# Altium project Arduino - FPGA Development Board.PrjPcb
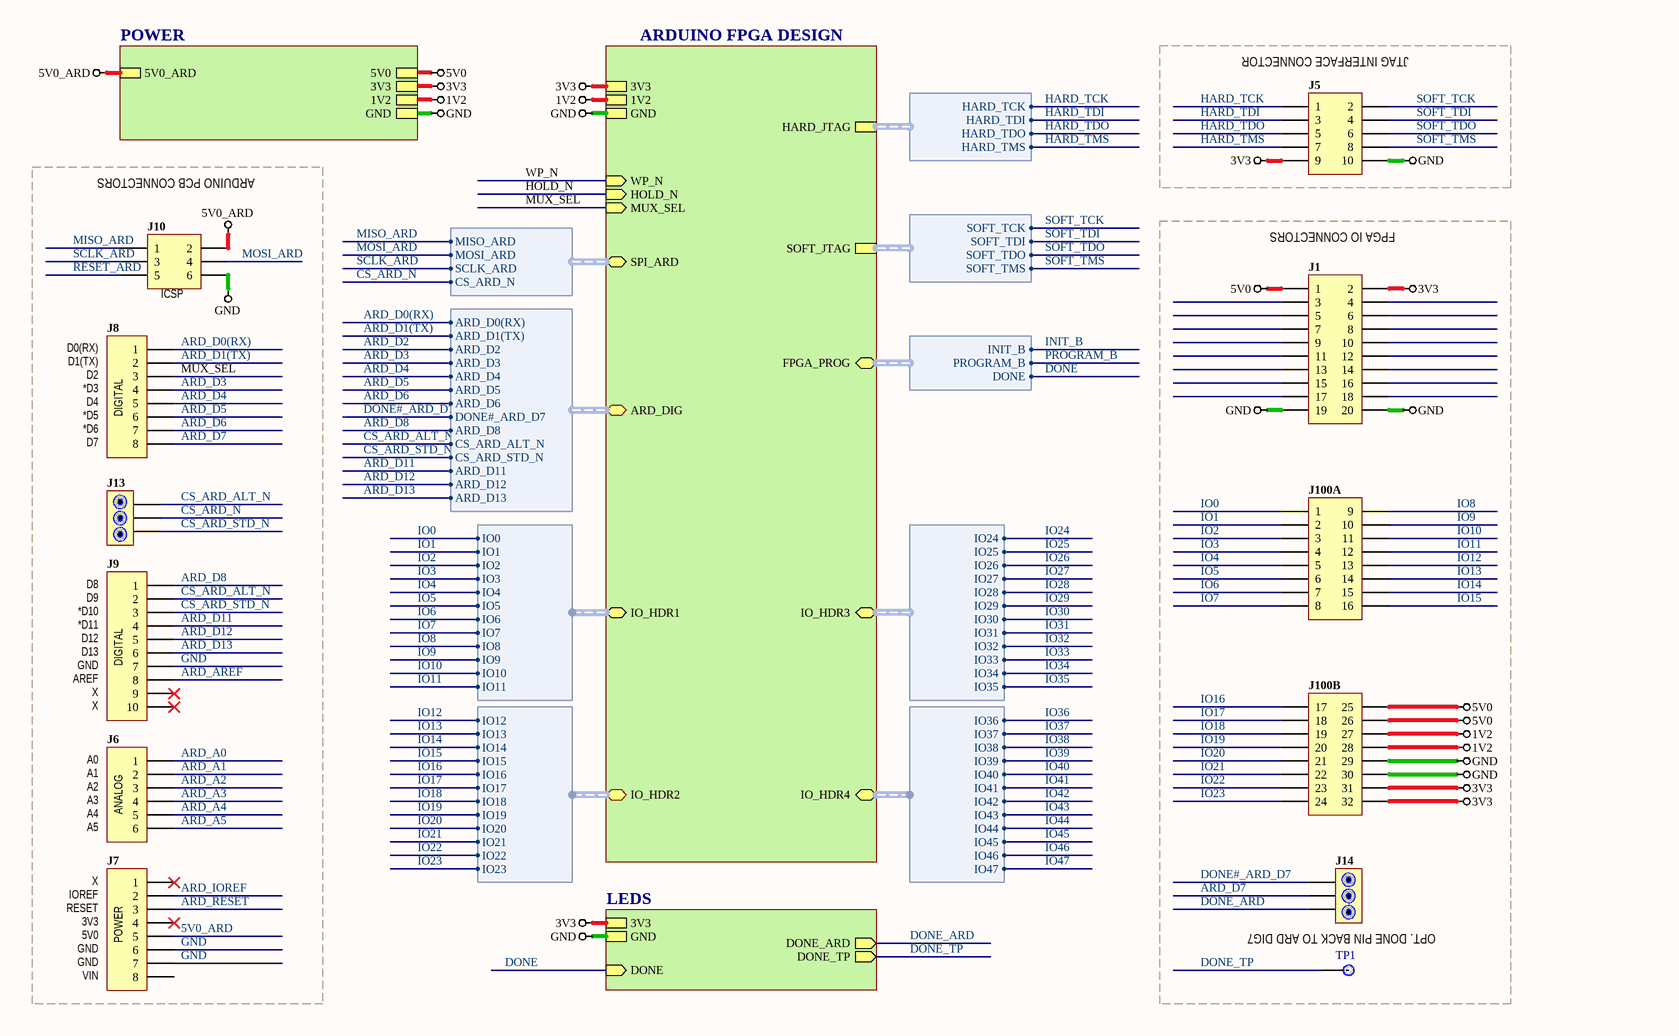
[diagram p0: Arduino FPGA Top-Level Interface.SchDoc]
10 sheets, 85 parts. Net scope: hierarchical (ports join the sheet entries above them; power ports are global).
Board file: Arduino_FPGA_Shield.PcbDoc
Sheets:
  Arduino FPGA Top-Level Interface.SchDoc
    ARDUINO FPGA DESIGN = Arduino FPGA Design.SchDoc
      FLASH_MEMORY = Flash - S25FL216K0PMFI041.SchDoc
      FPGA_SUBSYSTEM = FPGA - XC6SLX9-2TQG144C.schdoc
        U_FPGA - Decoupling = FPGA - Decoupling.SchDoc
      SPI MUX = Arduino FPGA SPI MUX.SchDoc
      SRAM0 = SRAM0 - IS61WV12816DBLL-10BLI.SchDoc
    POWER = Power - 5V0.SchDoc
      Power - 3V3 = Power - 3V3.SchDoc
    LEDS = LEDS - Status.SchDoc

## Sheet Arduino FPGA Top-Level Interface.SchDoc
size A4

### Parts
J1  Header 10X2  [HEADER_10X2]  (value not drawn)
J5  Header 5X2  [HDR2X5]  (value not drawn)
J6  Header 6  [1X06]  (value not drawn)
J7  Header 8  [1X08]  (value not drawn)
J8  Header 8  [1X08]  (value not drawn)
J9  Header 10  [1X10@1]  (value not drawn)
J10  Header 3X2  [2X03]  (value not drawn)
J13  3-WAY JUMPER  [HDR1X3]  (value not drawn)
J14  3-WAY JUMPER  [HDR1X3]  (value not drawn)
J100  ARR_32P  [ARR_100X100X32P]  (value not drawn)  (parts A,B of 2)
TP1  TESTPOINT_TH  [TESTPOINT_TH]  (value not drawn)

### Blocks framed on the sheet
JTAG INTERFACE CONNECTOR: J5
ARDUINO PCB CONNECTORS: J6-J10 J13

### Sub-sheets
ARDUINO FPGA DESIGN = Arduino FPGA Design.SchDoc: 3V3, GND, 1V2, HARD_JTAG (harness HARD_JTAG), SOFT_JTAG (harness SOFT_JTAG), WP_N (in), HOLD_N (in), IO_HDR2 (harness IO_HDR2), IO_HDR3 (harness IO_HDR3), IO_HDR4 (harness IO_HDR4), MUX_SEL (in), IO_HDR1 (harness IO_HDR1), FPGA_PROG (harness FPGA_PROGRAM), ARD_DIG (harness ARDUINO_DIGITAL), SPI_ARD (harness SPI_ARD)
LEDS = LEDS - Status.SchDoc: 3V3, GND, DONE (in), DONE_ARD (out), DONE_TP (out)
POWER = Power - 5V0.SchDoc: 5V0, 3V3, 1V2, GND, 5V0_ARD

### Harnesses
HARD_JTAG: HARD_TCK, HARD_TDI, HARD_TDO, HARD_TMS
SOFT_JTAG: SOFT_TCK, SOFT_TDI, SOFT_TDO, SOFT_TMS
FPGA_PROGRAM: INIT_B, PROGRAM_B, DONE
SPI_ARD: MISO_ARD, MOSI_ARD, SCLK_ARD, CS_ARD_N
IO_HDR1: IO0, IO1, IO2, IO3, IO4, IO5, IO6, IO7, IO8, IO9, IO10, IO11
IO_HDR3: IO24, IO25, IO26, IO27, IO28, IO29, IO30, IO31, IO32, IO33, IO34, IO35
IO_HDR4: IO36, IO37, IO38, IO39, IO40, IO41, IO42, IO43, IO44, IO45, IO46, IO47
IO_HDR2: IO12, IO13, IO16, IO17, IO18, IO19, IO20, IO21, IO22, IO23, IO14, IO15
ARDUINO_DIGITAL: ARD_D0(RX), ARD_D1(TX), ARD_D2, ARD_D3, ARD_D4, ARD_D5, ARD_D6, DONE#_ARD_D7, ARD_D8, CS_ARD_ALT_N, CS_ARD_STD_N, ARD_D11, ARD_D12, ARD_D13

### Nets
1V2: J100.27 J100.28 ; sheet ARDUINO FPGA DESIGN/1V2, sheet POWER/1V2
3V3: J1.2 J5.9 J100.31 J100.32 ; sheet ARDUINO FPGA DESIGN/3V3, sheet POWER/3V3, sheet LEDS/3V3
5V0: J1.1 J100.25 J100.26 ; sheet POWER/5V0
5V0_ARD: J7.5 ; sheet POWER/5V0_ARD
GND: J1.19 J1.20 J5.10 J7.6 J7.7 J9.7 J10.6 J100.29 J100.30 ; sheet ARDUINO FPGA DESIGN/GND, sheet POWER/GND, sheet LEDS/GND
ARD_A0: J6.1
ARD_A1: J6.2
ARD_A2: J6.3
ARD_A3: J6.4
ARD_A4: J6.5
ARD_A5: J6.6
ARD_AREF: J9.8
ARD_D0(RX): J8.1 ; sheet ARDUINO FPGA DESIGN/ARD_DIG.ARD_D0(RX)
ARD_D1(TX): J8.2 ; sheet ARDUINO FPGA DESIGN/ARD_DIG.ARD_D1(TX)
ARD_D2: sheet ARDUINO FPGA DESIGN/ARD_DIG.ARD_D2
ARD_D3: J8.4 ; sheet ARDUINO FPGA DESIGN/ARD_DIG.ARD_D3
ARD_D4: J8.5 ; sheet ARDUINO FPGA DESIGN/ARD_DIG.ARD_D4
ARD_D5: J8.6 ; sheet ARDUINO FPGA DESIGN/ARD_DIG.ARD_D5
ARD_D6: J8.7 ; sheet ARDUINO FPGA DESIGN/ARD_DIG.ARD_D6
ARD_D7: J8.8 J14.2
ARD_D8: J9.1 ; sheet ARDUINO FPGA DESIGN/ARD_DIG.ARD_D8
ARD_D11: J9.4 ; sheet ARDUINO FPGA DESIGN/ARD_DIG.ARD_D11
ARD_D12: J9.5 ; sheet ARDUINO FPGA DESIGN/ARD_DIG.ARD_D12
ARD_D13: J9.6 ; sheet ARDUINO FPGA DESIGN/ARD_DIG.ARD_D13
ARD_IOREF: J7.2
ARD_RESET: J7.3
CS_ARD_ALT_N: J9.2 J13.3 ; sheet ARDUINO FPGA DESIGN/ARD_DIG.CS_ARD_ALT_N
CS_ARD_N: J13.2 ; sheet ARDUINO FPGA DESIGN/SPI_ARD.CS_ARD_N
CS_ARD_STD_N: J9.3 J13.1 ; sheet ARDUINO FPGA DESIGN/ARD_DIG.CS_ARD_STD_N
DONE: sheet LEDS/DONE, sheet ARDUINO FPGA DESIGN/FPGA_PROG.DONE
DONE#_ARD_D7: J14.3 ; sheet ARDUINO FPGA DESIGN/ARD_DIG.DONE#_ARD_D7
DONE_ARD: J14.1 ; sheet LEDS/DONE_ARD
DONE_TP: TP1.1 ; sheet LEDS/DONE_TP
HARD_TCK: J5.1 ; sheet ARDUINO FPGA DESIGN/HARD_JTAG.HARD_TCK
HARD_TDI: J5.3 ; sheet ARDUINO FPGA DESIGN/HARD_JTAG.HARD_TDI
HARD_TDO: J5.5 ; sheet ARDUINO FPGA DESIGN/HARD_JTAG.HARD_TDO
HARD_TMS: J5.7 ; sheet ARDUINO FPGA DESIGN/HARD_JTAG.HARD_TMS
IO0: J100.1 ; sheet ARDUINO FPGA DESIGN/IO_HDR1.IO0
IO1: J100.2 ; sheet ARDUINO FPGA DESIGN/IO_HDR1.IO1
IO2: J100.3 ; sheet ARDUINO FPGA DESIGN/IO_HDR1.IO2
IO3: J100.4 ; sheet ARDUINO FPGA DESIGN/IO_HDR1.IO3
IO4: J100.5 ; sheet ARDUINO FPGA DESIGN/IO_HDR1.IO4
IO5: J100.6 ; sheet ARDUINO FPGA DESIGN/IO_HDR1.IO5
IO6: J100.7 ; sheet ARDUINO FPGA DESIGN/IO_HDR1.IO6
IO7: J100.8 ; sheet ARDUINO FPGA DESIGN/IO_HDR1.IO7
IO8: J100.9 ; sheet ARDUINO FPGA DESIGN/IO_HDR1.IO8
IO9: J100.10 ; sheet ARDUINO FPGA DESIGN/IO_HDR1.IO9
IO10: J100.11 ; sheet ARDUINO FPGA DESIGN/IO_HDR1.IO10
IO11: J100.12 ; sheet ARDUINO FPGA DESIGN/IO_HDR1.IO11
IO12: J100.13 ; sheet ARDUINO FPGA DESIGN/IO_HDR2.IO12
IO13: J100.14 ; sheet ARDUINO FPGA DESIGN/IO_HDR2.IO13
IO14: J100.15 ; sheet ARDUINO FPGA DESIGN/IO_HDR2.IO14
IO15: J100.16 ; sheet ARDUINO FPGA DESIGN/IO_HDR2.IO15
IO16: J100.17 ; sheet ARDUINO FPGA DESIGN/IO_HDR2.IO16
IO17: J100.18 ; sheet ARDUINO FPGA DESIGN/IO_HDR2.IO17
IO18: J100.19 ; sheet ARDUINO FPGA DESIGN/IO_HDR2.IO18
IO19: J100.20 ; sheet ARDUINO FPGA DESIGN/IO_HDR2.IO19
IO20: J100.21 ; sheet ARDUINO FPGA DESIGN/IO_HDR2.IO20
IO21: J100.22 ; sheet ARDUINO FPGA DESIGN/IO_HDR2.IO21
IO22: J100.23 ; sheet ARDUINO FPGA DESIGN/IO_HDR2.IO22
IO23: J100.24 ; sheet ARDUINO FPGA DESIGN/IO_HDR2.IO23
IO31: sheet ARDUINO FPGA DESIGN/IO_HDR3.IO31
IO32: sheet ARDUINO FPGA DESIGN/IO_HDR3.IO32
IO33: sheet ARDUINO FPGA DESIGN/IO_HDR3.IO33
IO34: sheet ARDUINO FPGA DESIGN/IO_HDR3.IO34
IO35: sheet ARDUINO FPGA DESIGN/IO_HDR3.IO35
IO36: sheet ARDUINO FPGA DESIGN/IO_HDR4.IO36
IO37: sheet ARDUINO FPGA DESIGN/IO_HDR4.IO37
IO38: sheet ARDUINO FPGA DESIGN/IO_HDR4.IO38
IO39: sheet ARDUINO FPGA DESIGN/IO_HDR4.IO39
IO40: sheet ARDUINO FPGA DESIGN/IO_HDR4.IO40
IO41: sheet ARDUINO FPGA DESIGN/IO_HDR4.IO41
IO42: sheet ARDUINO FPGA DESIGN/IO_HDR4.IO42
IO43: sheet ARDUINO FPGA DESIGN/IO_HDR4.IO43
IO44: sheet ARDUINO FPGA DESIGN/IO_HDR4.IO44
IO45: sheet ARDUINO FPGA DESIGN/IO_HDR4.IO45
IO46: sheet ARDUINO FPGA DESIGN/IO_HDR4.IO46
IO47: sheet ARDUINO FPGA DESIGN/IO_HDR4.IO47
MISO_ARD: J10.1 ; sheet ARDUINO FPGA DESIGN/SPI_ARD.MISO_ARD
MOSI_ARD: J10.4 ; sheet ARDUINO FPGA DESIGN/SPI_ARD.MOSI_ARD
MUX_SEL: J8.3 ; sheet ARDUINO FPGA DESIGN/MUX_SEL
RESET_ARD: J10.5
SCLK_ARD: J10.3 ; sheet ARDUINO FPGA DESIGN/SPI_ARD.SCLK_ARD
SOFT_TCK: J5.2 ; sheet ARDUINO FPGA DESIGN/SOFT_JTAG.SOFT_TCK
SOFT_TDI: J5.4 ; sheet ARDUINO FPGA DESIGN/SOFT_JTAG.SOFT_TDI
SOFT_TDO: J5.6 ; sheet ARDUINO FPGA DESIGN/SOFT_JTAG.SOFT_TDO
SOFT_TMS: J5.8 ; sheet ARDUINO FPGA DESIGN/SOFT_JTAG.SOFT_TMS

Not connected (* = marked no-connect by the designer): J1 3 4 5 6 7 8 9 10 11 12 13 14 15 16 17 18; J7 1* 4* 8; J9 9* 10*; J10 2

### Notes on the sheet
- FPGA IO CONNECTORS
- (near J10) ICSP
- (near J8) D0(RX)
- (near J8) D1(TX)
- (near J8) D2
- (near J8) *D3
- (near J8) D4
- (near J8) *D5
- (near J8) *D6
- D7
- (near J8) DIGITAL
- D8
- D9
- (near J9) *D10
- (near J9) *D11
- (near J9) D12
- (near J9) D13
- (near J9) GND
- (near J9) AREF
- (near J9) X
- X
- (near J9) DIGITAL
- A0
- (near J6) A1
- (near J6) A2
- (near J6) A3
- (near J6) A4
- A5
- (near J6) ANALOG
- (near J7) IOREF
- (near J7) RESET
- (near J7) 3V3
- OPT. DONE PIN BACK TO ARD DIG7
- (near J7) 5V0
- (near J7) GND
- (near J7) VIN
- (near J7) POWER
- Labels drawn without touching a wire or pin: 5V0_ARD

### Library data of the parts
J1 = Header 10X2: Header, 10-Pin, Dual row; LatestRevisionDate: 17-Jul-2002; LatestRevisionNote: Re-released for DXP Platform.; Publisher: Altium Limited
J5 = Header 5X2: Header, 5-Pin, Dual row; LatestRevisionDate: 17-Jul-2002; LatestRevisionNote: Re-released for DXP Platform.; Publisher: Altium Limited
J6 = Header 6: Header, 6-Pin; LatestRevisionDate: 17-Jul-2002; LatestRevisionNote: Re-released for DXP Platform.; Publisher: Altium Limited
J7 J8 = Header 8: Header, 8-Pin; LatestRevisionDate: 17-Jul-2002; LatestRevisionNote: Re-released for DXP Platform.; Publisher: Altium Limited
J9 = Header 10: Header, 10-Pin; LatestRevisionDate: 17-Jul-2002; LatestRevisionNote: Re-released for DXP Platform.; Publisher: Altium Limited
J10 = Header 3X2: Header, 3-Pin, Dual row; LatestRevisionDate: 17-Jul-2002; LatestRevisionNote: Re-released for DXP Platform.; Publisher: Altium Limited
J13 J14 = 3-WAY JUMPER: 3-Way Jumper - Center Output
J100 = ARR_32P: Pad Array - 32 Pins 100X100mil spacing

## Sheet Arduino FPGA Design.SchDoc
size A4
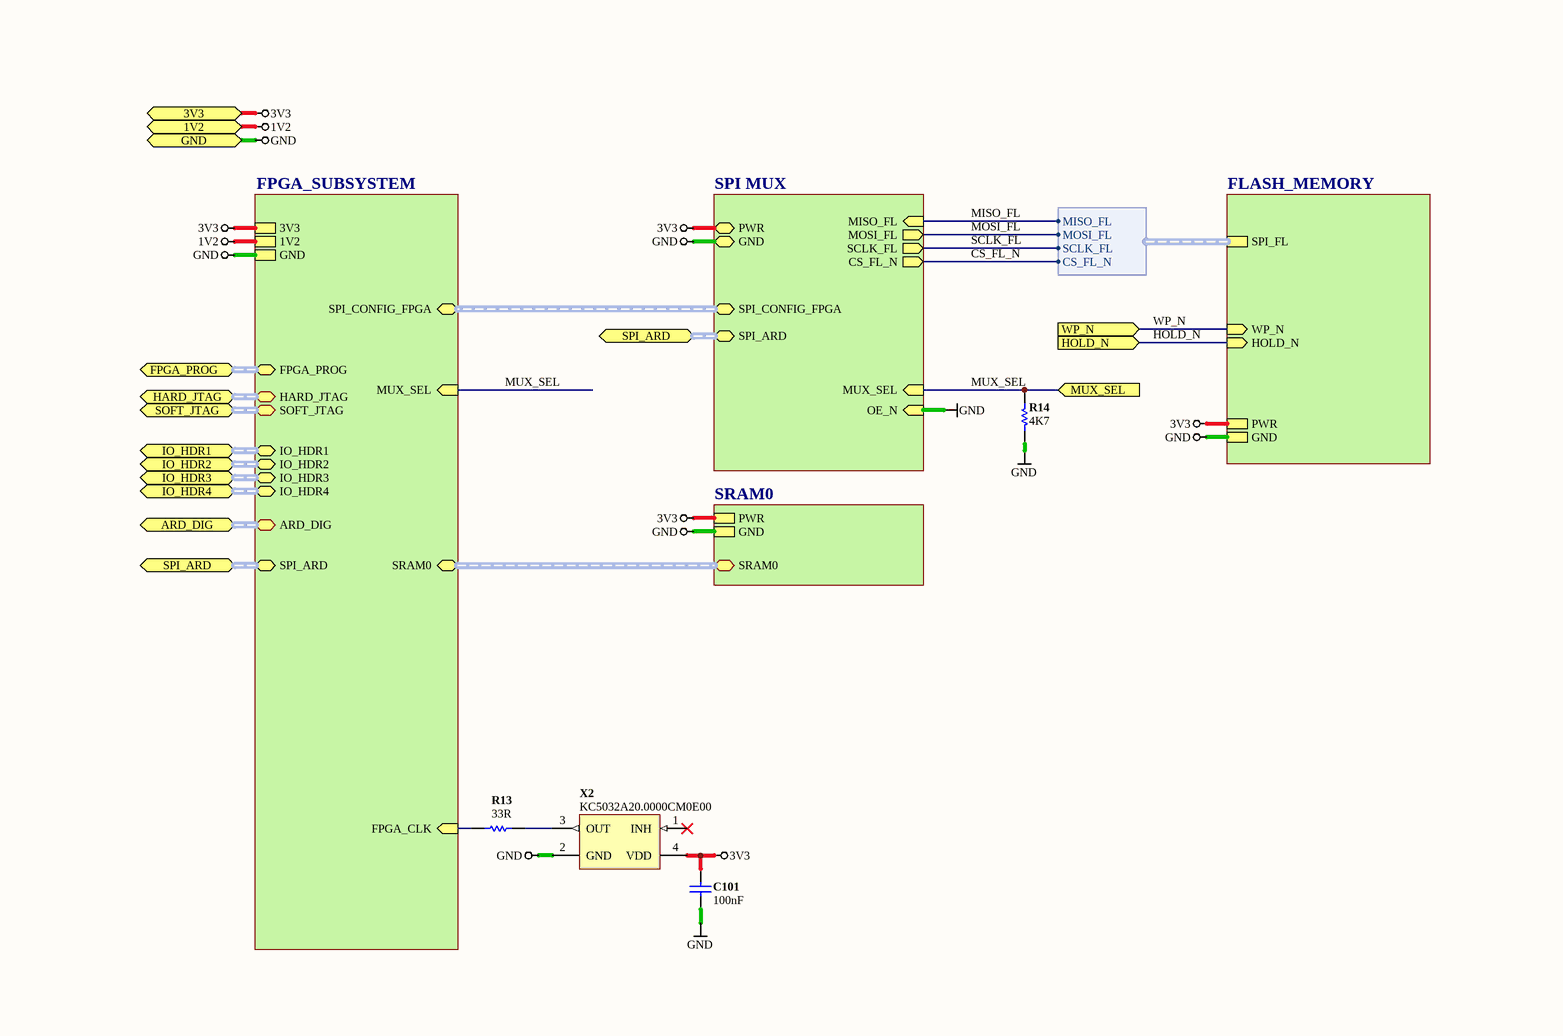
[diagram p1: Arduino FPGA Design.SchDoc]

### Parts
C101  value 100nF  [CAPC0402(1005)60_L]  (hidden comment: CAP 100nF 16V 0402(1005))
R13  value 33R  [RESC0402(1005)40_L]  (hidden comment: 33R 1 0402)
R14  value 4K7  [RESC0402(1005)40_L]  (hidden comment: 4K7 1 0402)
X2  KC5032A20.0000CM0E00  [HOSC-L500HW320H105-4_2]

### Sub-sheets
FLASH_MEMORY = Flash - S25FL216K0PMFI041.SchDoc: SPI_FL (harness SPI_FLASH), PWR, WP_N (in), HOLD_N (in), GND
FPGA_SUBSYSTEM = FPGA - XC6SLX9-2TQG144C.schdoc: 3V3, GND, 1V2, FPGA_CLK (in), HARD_JTAG (harness HARD_JTAG), SOFT_JTAG (harness SOFT_JTAG), IO_HDR3 (harness IO_HDR3), IO_HDR4 (harness IO_HDR4), SPI_CONFIG_FPGA (harness SPI_CONFIG_FPGA), FPGA_PROG (harness FPGA_PROGRAM), IO_HDR1 (harness IO_HDR1), IO_HDR2 (harness IO_HDR2), SRAM0 (harness SRAM0), ARD_DIG (harness ARDUINO_DIGITAL), SPI_ARD (harness SPI_ARD), MUX_SEL (in)
SPI MUX = Arduino FPGA SPI MUX.SchDoc: MISO_FL (in), MOSI_FL (out), SCLK_FL (out), CS_FL_N (out), OE_N (in), MUX_SEL (in), SPI_CONFIG_FPGA (harness SPI_CONFIG_FPGA), PWR, GND, SPI_ARD (harness SPI_ARD)
SRAM0 = SRAM0 - IS61WV12816DBLL-10BLI.SchDoc: PWR, GND, SRAM0 (harness SRAM0)

### Ports
1V2, 3V3, ARD_DIG (harness ARDUINO_DIGITAL), FPGA_PROG (harness FPGA_PROGRAM), GND, HARD_JTAG (harness HARD_JTAG), HOLD_N (in), IO_HDR1 (harness IO_HDR1), IO_HDR2 (harness IO_HDR2), IO_HDR3 (harness IO_HDR3), IO_HDR4 (harness IO_HDR4), MUX_SEL (in), SOFT_JTAG (harness SOFT_JTAG), SPI_ARD (harness SPI_ARD), WP_N (in)

### Harnesses
SPI_FLASH: MOSI_FL, MISO_FL, SCLK_FL, CS_FL_N

### Nets
1V2: port 1V2, sheet FPGA_SUBSYSTEM/1V2
3V3: C101.1 X2.4(VDD) ; port 3V3, sheet FLASH_MEMORY/PWR, sheet FPGA_SUBSYSTEM/3V3, sheet SPI MUX/PWR, sheet SRAM0/PWR
GND: C101.2 R14.1 X2.2(GND) ; port GND, sheet FLASH_MEMORY/GND, sheet FPGA_SUBSYSTEM/GND, sheet SPI MUX/OE_N, sheet SPI MUX/GND, sheet SRAM0/GND
CS_FL_N: sheet SPI MUX/CS_FL_N, sheet FLASH_MEMORY/SPI_FL.CS_FL_N
FPGA_CLK: R13.1 ; sheet FPGA_SUBSYSTEM/FPGA_CLK
HOLD_N: port HOLD_N, sheet FLASH_MEMORY/HOLD_N
MISO_FL: sheet SPI MUX/MISO_FL, sheet FLASH_MEMORY/SPI_FL.MISO_FL
MOSI_FL: sheet SPI MUX/MOSI_FL, sheet FLASH_MEMORY/SPI_FL.MOSI_FL
MUX_SEL: R14.2 ; port MUX_SEL, sheet FPGA_SUBSYSTEM/MUX_SEL, sheet SPI MUX/MUX_SEL
SCLK_FL: sheet SPI MUX/SCLK_FL, sheet FLASH_MEMORY/SPI_FL.SCLK_FL
WP_N: port WP_N, sheet FLASH_MEMORY/WP_N
NetR13_2: R13.2 X2.3(OUT)

Not connected (* = marked no-connect by the designer): X2 1(INH)*

### Buses and harness runs
harness port ARD_DIG = sheet FPGA_SUBSYSTEM/ARD_DIG
harness port FPGA_PROG = sheet FPGA_SUBSYSTEM/FPGA_PROG
harness port HARD_JTAG = sheet FPGA_SUBSYSTEM/HARD_JTAG
harness port IO_HDR1 = sheet FPGA_SUBSYSTEM/IO_HDR1
harness port IO_HDR2 = sheet FPGA_SUBSYSTEM/IO_HDR2
harness port IO_HDR3 = sheet FPGA_SUBSYSTEM/IO_HDR3
harness port IO_HDR4 = sheet FPGA_SUBSYSTEM/IO_HDR4
harness port SOFT_JTAG = sheet FPGA_SUBSYSTEM/SOFT_JTAG
harness port SPI_ARD = sheet FPGA_SUBSYSTEM/SPI_ARD
harness port SPI_ARD = sheet SPI MUX/SPI_ARD
harness sheet FPGA_SUBSYSTEM/SPI_CONFIG_FPGA = sheet SPI MUX/SPI_CONFIG_FPGA
harness sheet FPGA_SUBSYSTEM/SRAM0 = sheet SRAM0/SRAM0

### Library data of the parts
C101 = CAP 100nF 16V ±10% 0402 (1005 Metric) Thickness 0.6mm SMD: Case-EIA: 0402; Case-Metric: 1005; Tolerance: ±10%; Max Thickness: 0.6 mm; Rated Voltage: 16 V; Technology: SMT
R13 = 0402 (1005 Metric) 1/16 W 33R 1 Thick Film Chip Resistor: Case-EIA: 0402; Case-Metric: 1005; Temp Coefficient ppm/°C: ±100; Tolerance %: 1%; Value (Ohms): 33; Power: 1/16 W; Technology: SMT
R14 = 0402 (1005 Metric) 1/16 W 4K7 1 Thick Film Chip Resistor: Case-EIA: 0402; Case-Metric: 1005; Power: 1/16 W; Temp Coefficient ppm/°C: ±100; Tolerance %: 1%; Value (Ohms): 4700; Technology: SMT
X2 = OSCILLATOR 20.0000MHZ SMD: PartNumber: HCX-C2-20M; DefaultDesignator: X?; Class: Oscillators; Frequency: 20.00 MHZ; Output: CMOS; Supply Voltage: 3V3, 5V0; ComponentLink1Description: Datasheet; ComponentLink1URL: http://www.hongkongcrystal.com/upload/product/original/347881837473.pdf; ComponentLink2Description: Manufacturer; ComponentLink2URL: http://global.kyocera.com/; Type: XO (Standard)

## Sheet Flash - S25FL216K0PMFI041.SchDoc
size A4; minSupply: 2V4; maxSupply: 3V7
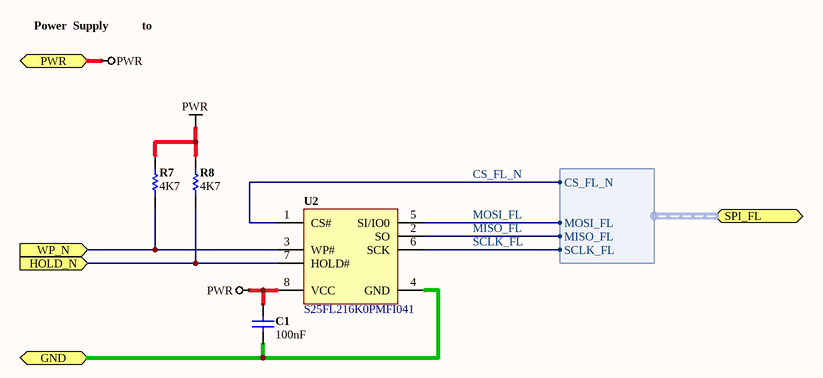
[diagram p2: Flash - S25FL216K0PMFI041.SchDoc]

### Parts
C1  value 100nF  [CAPC0402(1005)60_L]  (hidden comment: CAP 100nF 16V 0402(1005))
R7  4K7  [RESC0402(1005)40_L]
R8  4K7  [RESC0402(1005)40_L]
U2  S25FL216K0PMFI041  [SPANSION-SOIC127P600X175-8M]

### Ports
GND, HOLD_N (in), PWR, SPI_FL (harness SPI_FLASH), WP_N (in)

### Harnesses
SPI_FLASH: MOSI_FL, MISO_FL, SCLK_FL, CS_FL_N

### Nets
GND: C1.2 U2.4(GND) ; port GND
PWR: C1.1 R7.2 R8.2 U2.8(VCC) ; port PWR  [project net 3V3]
CS_FL_N: U2.1(CS#) ; port SPI_FL.CS_FL_N
HOLD_N: R8.1 U2.7(HOLD#) ; port HOLD_N
MISO_FL: U2.2(SO) ; port SPI_FL.MISO_FL
MOSI_FL: U2.5(SI/IO0) ; port SPI_FL.MOSI_FL
SCLK_FL: U2.6(SCK) ; port SPI_FL.SCLK_FL
WP_N: R7.1 U2.3(WP#) ; port WP_N

### Notes on the sheet
- Power  Supply
- to

### Library data of the parts
C1 = CAP 100nF 16V ±10% 0402 (1005 Metric) Thickness 0.6mm SMD: as C101 on sheet Arduino FPGA Design; Max Thickness: 0.6 mm; Rated Voltage: 16 V; Technology: SMT
R7 R8 = 0402 (1005 Metric) 1/16 W 4K7 1 Thick Film Chip Resistor: Case-EIA: 0402; Case-Metric: 1005; Temp Coefficient ppm/°C: ±100; Tolerance %: 1%; Value (Ohms): 4700; Power: 1/16 W; Value: 4K7; Technology: SMT
U2 = S25FL216K0PMFI041: 16-Mbit 3.0V Serial Flash Memory with Uniform 4 kB Sectors; ComponentLink1Description: Locate on FindChips.com; ComponentLink1URL: http://www.findchips.com/search/s25fl216k0pmfi041; Manufacturer Part Number: S25FL216K0PMFI041; ComponentLink2Description: Locate on Datasheet.Net; ComponentLink2URL: http://www.datasheet.net/document/566207/

## Sheet FPGA - XC6SLX9-2TQG144C.schdoc
size B
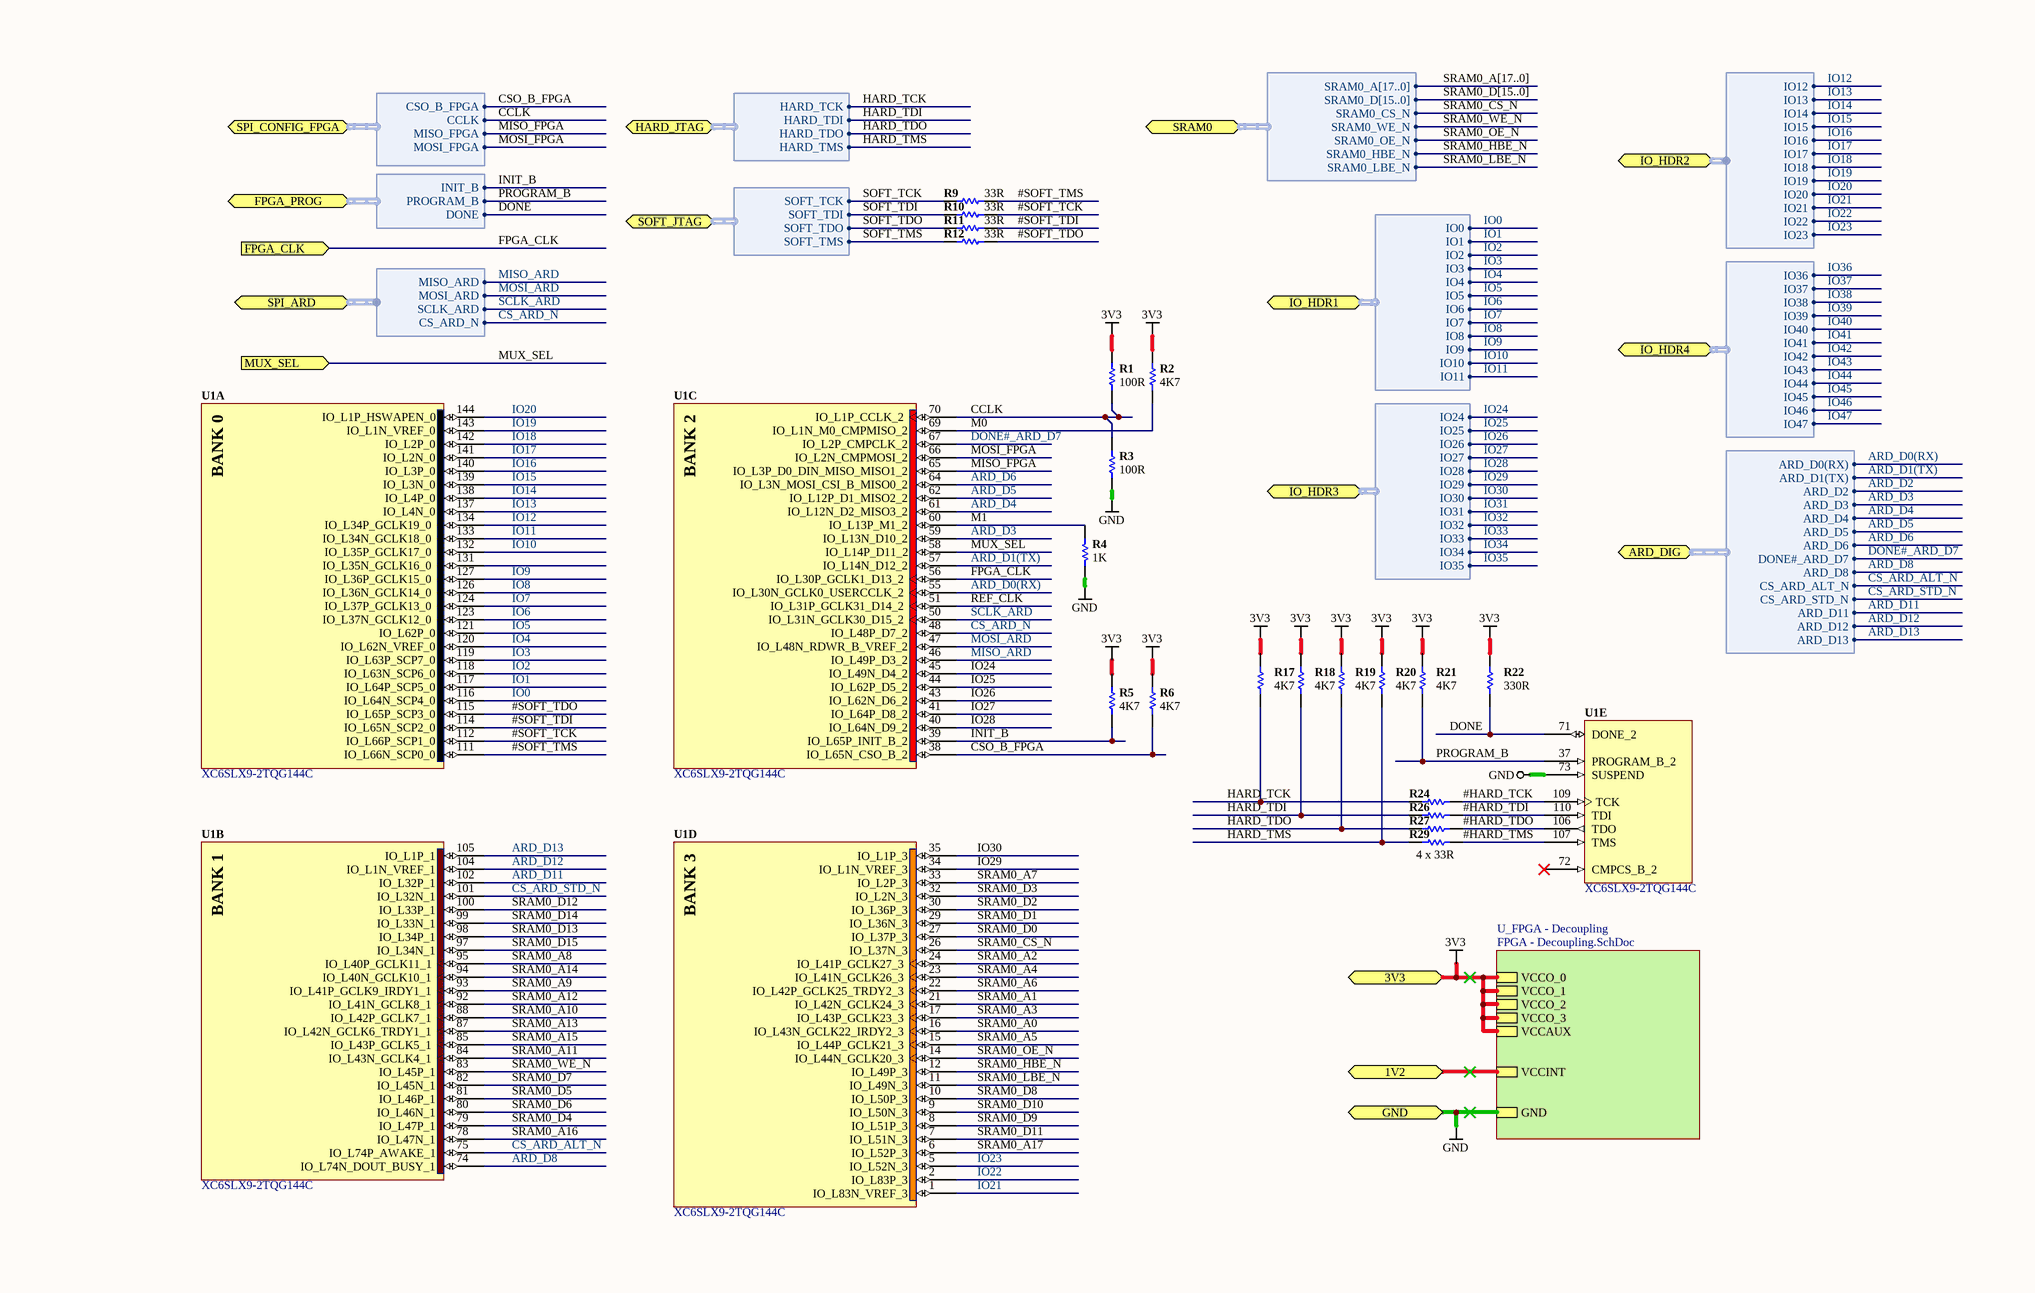
[diagram p3: FPGA - XC6SLX9-2TQG144C.schdoc]

### Parts
(Parts that share a designator on the sheet are numbered #1, #2 ... from top to bottom, then left to right.)
R1  value 100R  [RESC0402(1005)40_L]  (hidden comment: 100R 1 0402)
R2  value 4K7  [RESC0402(1005)40_L]  (hidden comment: 4K7 1 0402)
R3  value 100R  [RESC0402(1005)40_L]  (hidden comment: 100R 1 0402)
R4  value 1K  [RESC0402(1005)40_L]  (hidden comment: 1K 1 0402)
R5  value 4K7  [RESC0402(1005)40_L]  (hidden comment: 4K7 1 0402)
R6  value 4K7  [RESC0402(1005)40_L]  (hidden comment: 4K7 1 0402)
R9  value 33R  [RESC0402(1005)40_L]  (hidden comment: 33R 1 0402)
R10  value 33R  [RESC0402(1005)40_L]  (hidden comment: 33R 1 0402)
R11  value 33R  [RESC0402(1005)40_L]  (hidden comment: 33R 1 0402)
R12  value 33R  [RESC0402(1005)40_L]  (hidden comment: 33R 1 0402)
R17  value 4K7  [RESC0402(1005)40_L]  (hidden comment: 4K7 1 0402)
R18  value 4K7  [RESC0402(1005)40_L]  (hidden comment: 4K7 1 0402)
R19  value 4K7  [RESC0402(1005)40_L]  (hidden comment: 4K7 1 0402)
R20  value 4K7  [RESC0402(1005)40_L]  (hidden comment: 4K7 1 0402)
R21  value 4K7  [RESC0402(1005)40_L]  (hidden comment: 4K7 1 0402)
R22  value 330R  [RESC0402(1005)40_L]  (hidden comment: 330R 1 0402)
R24  33R 1 0402  [RESC0402(1005)40_L]  (value not drawn)
R26  33R 1 0402  [RESC0402(1005)40_L]  (value not drawn)
R27  33R 1 0402  [RESC0402(1005)40_L]  (value not drawn)
R29  33R 1 0402  [RESC0402(1005)40_L]  (value not drawn)
U1#1  XC6SLX9-2TQG144C  [TQG144_N]  (parts A,B,D,E of 7)
U1#2  XC6SLX9-2TQG144C  [TQG144_N]  (part C of 7)

### Sub-sheets
U_FPGA - Decoupling = FPGA - Decoupling.SchDoc: VCCO_0, VCCO_3, VCCO_1, VCCO_2, VCCAUX, VCCINT, GND

### Ports
1V2, 3V3, ARD_DIG (harness ARDUINO_DIGITAL), FPGA_CLK (in), FPGA_PROG (harness FPGA_PROGRAM), GND, HARD_JTAG (harness HARD_JTAG), IO_HDR1 (harness IO_HDR1), IO_HDR2 (harness IO_HDR2), IO_HDR3 (harness IO_HDR3), IO_HDR4 (harness IO_HDR4), MUX_SEL (in), SOFT_JTAG (harness SOFT_JTAG), SPI_ARD (harness SPI_ARD), SPI_CONFIG_FPGA (harness SPI_CONFIG_FPGA), SRAM0 (harness SRAM0)

### Harnesses
SPI_CONFIG_FPGA: CSO_B_FPGA, CCLK, MISO_FPGA, MOSI_FPGA
HARD_JTAG: HARD_TCK, HARD_TDI, HARD_TDO, HARD_TMS
SOFT_JTAG: SOFT_TCK, SOFT_TDI, SOFT_TDO, SOFT_TMS
IO_HDR1: IO0, IO1, IO2, IO3, IO4, IO5, IO6, IO7, IO8, IO9, IO10, IO11
IO_HDR3: IO24, IO25, IO26, IO27, IO28, IO29, IO30, IO31, IO32, IO33, IO34, IO35
IO_HDR4: IO36, IO37, IO38, IO39, IO40, IO41, IO42, IO43, IO44, IO45, IO46, IO47
FPGA_PROGRAM: INIT_B, PROGRAM_B, DONE
IO_HDR2: IO12, IO13, IO16, IO17, IO18, IO19, IO20, IO21, IO22, IO23, IO14, IO15
SRAM0: SRAM0_A[17..0], SRAM0_D[15..0], SRAM0_CS_N, SRAM0_WE_N, SRAM0_OE_N, SRAM0_HBE_N, SRAM0_LBE_N
ARDUINO_DIGITAL: ARD_D0(RX), ARD_D1(TX), ARD_D2, ARD_D3, ARD_D4, ARD_D5, ARD_D6, DONE#_ARD_D7, ARD_D8, CS_ARD_ALT_N, CS_ARD_STD_N, ARD_D11, ARD_D12, ARD_D13
SPI_ARD: MISO_ARD, MOSI_ARD, SCLK_ARD, CS_ARD_N

### Nets
1V2: port 1V2, sheet U_FPGA - Decoupling/VCCINT
3V3: R1.2 R2.2 R5.2 R6.2 R17.2 R18.2 R19.2 R20.2 R21.2 R22.2 ; port 3V3, sheet U_FPGA - Decoupling/VCCO_0, sheet U_FPGA - Decoupling/VCCO_3, sheet U_FPGA - Decoupling/VCCO_1, sheet U_FPGA - Decoupling/VCCO_2, sheet U_FPGA - Decoupling/VCCAUX
GND: R3.1 R4.1 U1#1.73(SUSPEND) ; port GND, sheet U_FPGA - Decoupling/GND
#HARD_TCK: R24.2 U1#1.109(TCK)
#HARD_TDI: R26.2 U1#1.110(TDI)
#HARD_TDO: R27.2 U1#1.106(TDO)
#HARD_TMS: R29.2 U1#1.107(TMS)
#SOFT_TCK: R10.2 U1#1.112(IO_L66P_SCP1_0)
#SOFT_TDI: R11.2 U1#1.114(IO_L65N_SCP2_0)
#SOFT_TDO: R12.2 U1#1.115(IO_L65P_SCP3_0)
#SOFT_TMS: R9.2 U1#1.111(IO_L66N_SCP0_0)
ARD_D0(RX): U1#2.55(IO_L30N_GCLK0_USERCCLK_2) ; port ARD_DIG.ARD_D0(RX)
ARD_D1(TX): U1#2.57(IO_L14N_D12_2) ; port ARD_DIG.ARD_D1(TX)
ARD_D2: port ARD_DIG.ARD_D2
ARD_D3: U1#2.59(IO_L13N_D10_2) ; port ARD_DIG.ARD_D3
ARD_D4: U1#2.61(IO_L12N_D2_MISO3_2) ; port ARD_DIG.ARD_D4
ARD_D5: U1#2.62(IO_L12P_D1_MISO2_2) ; port ARD_DIG.ARD_D5
ARD_D6: U1#2.64(IO_L3N_MOSI_CSI_B_MISO0_2) ; port ARD_DIG.ARD_D6
ARD_D8: U1#1.74(IO_L74N_DOUT_BUSY_1) ; port ARD_DIG.ARD_D8
ARD_D11: U1#1.102(IO_L32P_1) ; port ARD_DIG.ARD_D11
ARD_D12: U1#1.104(IO_L1N_VREF_1) ; port ARD_DIG.ARD_D12
ARD_D13: U1#1.105(IO_L1P_1) ; port ARD_DIG.ARD_D13
CCLK: R1.1 R3.2 U1#2.70(IO_L1P_CCLK_2) ; port SPI_CONFIG_FPGA.CCLK
CS_ARD_ALT_N: U1#1.75(IO_L74P_AWAKE_1) ; port ARD_DIG.CS_ARD_ALT_N
CS_ARD_N: U1#2.48(IO_L48P_D7_2) ; port SPI_ARD.CS_ARD_N
CS_ARD_STD_N: U1#1.101(IO_L32N_1) ; port ARD_DIG.CS_ARD_STD_N
CSO_B_FPGA: R6.1 U1#2.38(IO_L65N_CSO_B_2) ; port SPI_CONFIG_FPGA.CSO_B_FPGA
DONE: R22.1 U1#1.71(DONE_2) ; port FPGA_PROG.DONE
DONE#_ARD_D7: U1#2.67(IO_L2P_CMPCLK_2) ; port ARD_DIG.DONE#_ARD_D7
FPGA_CLK: U1#2.56(IO_L30P_GCLK1_D13_2) ; port FPGA_CLK
HARD_TCK: R17.1 R24.1 ; port HARD_JTAG.HARD_TCK
HARD_TDI: R18.1 R26.1 ; port HARD_JTAG.HARD_TDI
HARD_TDO: R19.1 R27.1 ; port HARD_JTAG.HARD_TDO
HARD_TMS: R20.1 R29.1 ; port HARD_JTAG.HARD_TMS
INIT_B: R5.1 U1#2.39(IO_L65P_INIT_B_2) ; port FPGA_PROG.INIT_B
IO0: U1#1.116(IO_L64N_SCP4_0) ; port IO_HDR1.IO0
IO1: U1#1.117(IO_L64P_SCP5_0) ; port IO_HDR1.IO1
IO2: U1#1.118(IO_L63N_SCP6_0) ; port IO_HDR1.IO2
IO3: U1#1.119(IO_L63P_SCP7_0) ; port IO_HDR1.IO3
IO4: U1#1.120(IO_L62N_VREF_0) ; port IO_HDR1.IO4
IO5: U1#1.121(IO_L62P_0) ; port IO_HDR1.IO5
IO6: U1#1.123(IO_L37N_GCLK12_0) ; port IO_HDR1.IO6
IO7: U1#1.124(IO_L37P_GCLK13_0) ; port IO_HDR1.IO7
IO8: U1#1.126(IO_L36N_GCLK14_0) ; port IO_HDR1.IO8
IO9: U1#1.127(IO_L36P_GCLK15_0) ; port IO_HDR1.IO9
IO10: U1#1.132(IO_L35P_GCLK17_0) ; port IO_HDR1.IO10
IO11: U1#1.133(IO_L34N_GCLK18_0) ; port IO_HDR1.IO11
IO12: U1#1.134(IO_L34P_GCLK19_0) ; port IO_HDR2.IO12
IO13: U1#1.137(IO_L4N_0) ; port IO_HDR2.IO13
IO14: U1#1.138(IO_L4P_0) ; port IO_HDR2.IO14
IO15: U1#1.139(IO_L3N_0) ; port IO_HDR2.IO15
IO16: U1#1.140(IO_L3P_0) ; port IO_HDR2.IO16
IO17: U1#1.141(IO_L2N_0) ; port IO_HDR2.IO17
IO18: U1#1.142(IO_L2P_0) ; port IO_HDR2.IO18
IO19: U1#1.143(IO_L1N_VREF_0) ; port IO_HDR2.IO19
IO20: U1#1.144(IO_L1P_HSWAPEN_0) ; port IO_HDR2.IO20
IO21: U1#1.1(IO_L83N_VREF_3) ; port IO_HDR2.IO21
IO22: U1#1.2(IO_L83P_3) ; port IO_HDR2.IO22
IO23: U1#1.5(IO_L52N_3) ; port IO_HDR2.IO23
IO24: U1#2.45(IO_L49N_D4_2) ; port IO_HDR3.IO24
IO25: U1#2.44(IO_L62P_D5_2) ; port IO_HDR3.IO25
IO26: U1#2.43(IO_L62N_D6_2) ; port IO_HDR3.IO26
IO27: U1#2.41(IO_L64P_D8_2) ; port IO_HDR3.IO27
IO28: U1#2.40(IO_L64N_D9_2) ; port IO_HDR3.IO28
IO29: U1#1.34(IO_L1N_VREF_3) ; port IO_HDR3.IO29
IO30: U1#1.35(IO_L1P_3) ; port IO_HDR3.IO30
IO31: port IO_HDR3.IO31
IO32: port IO_HDR3.IO32
IO33: port IO_HDR3.IO33
IO34: port IO_HDR3.IO34
IO35: port IO_HDR3.IO35
IO36: port IO_HDR4.IO36
IO37: port IO_HDR4.IO37
IO38: port IO_HDR4.IO38
IO39: port IO_HDR4.IO39
IO40: port IO_HDR4.IO40
IO41: port IO_HDR4.IO41
IO42: port IO_HDR4.IO42
IO43: port IO_HDR4.IO43
IO44: port IO_HDR4.IO44
IO45: port IO_HDR4.IO45
IO46: port IO_HDR4.IO46
IO47: port IO_HDR4.IO47
M0: R2.1 U1#2.69(IO_L1N_M0_CMPMISO_2)
M1: R4.2 U1#2.60(IO_L13P_M1_2)
MISO_ARD: U1#2.46(IO_L49P_D3_2) ; port SPI_ARD.MISO_ARD
MISO_FPGA: U1#2.65(IO_L3P_D0_DIN_MISO_MISO1_2) ; port SPI_CONFIG_FPGA.MISO_FPGA
MOSI_ARD: U1#2.47(IO_L48N_RDWR_B_VREF_2) ; port SPI_ARD.MOSI_ARD
MOSI_FPGA: U1#2.66(IO_L2N_CMPMOSI_2) ; port SPI_CONFIG_FPGA.MOSI_FPGA
MUX_SEL: U1#2.58(IO_L14P_D11_2) ; port MUX_SEL
PROGRAM_B: R21.1 U1#1.37(PROGRAM_B_2) ; port FPGA_PROG.PROGRAM_B
REF_CLK: U1#2.51(IO_L31P_GCLK31_D14_2)
SCLK_ARD: U1#2.50(IO_L31N_GCLK30_D15_2) ; port SPI_ARD.SCLK_ARD
SOFT_TCK: R9.1 ; port SOFT_JTAG.SOFT_TCK
SOFT_TDI: R10.1 ; port SOFT_JTAG.SOFT_TDI
SOFT_TDO: R11.1 ; port SOFT_JTAG.SOFT_TDO
SOFT_TMS: R12.1 ; port SOFT_JTAG.SOFT_TMS
SRAM0_A0: U1#1.16(IO_L43N_GCLK22_IRDY2_3)
SRAM0_A1: U1#1.21(IO_L42N_GCLK24_3)
SRAM0_A2: U1#1.24(IO_L41P_GCLK27_3)
SRAM0_A3: U1#1.17(IO_L43P_GCLK23_3)
SRAM0_A4: U1#1.23(IO_L41N_GCLK26_3)
SRAM0_A5: U1#1.15(IO_L44P_GCLK21_3)
SRAM0_A6: U1#1.22(IO_L42P_GCLK25_TRDY2_3)
SRAM0_A7: U1#1.33(IO_L2P_3)
SRAM0_A8: U1#1.95(IO_L40P_GCLK11_1)
SRAM0_A9: U1#1.93(IO_L41P_GCLK9_IRDY1_1)
SRAM0_A10: U1#1.88(IO_L42P_GCLK7_1)
SRAM0_A11: U1#1.84(IO_L43N_GCLK4_1)
SRAM0_A12: U1#1.92(IO_L41N_GCLK8_1)
SRAM0_A13: U1#1.87(IO_L42N_GCLK6_TRDY1_1)
SRAM0_A14: U1#1.94(IO_L40N_GCLK10_1)
SRAM0_A15: U1#1.85(IO_L43P_GCLK5_1)
SRAM0_A16: U1#1.78(IO_L47N_1)
SRAM0_A17: U1#1.6(IO_L52P_3)
SRAM0_CS_N: U1#1.26(IO_L37N_3) ; port SRAM0.SRAM0_CS_N
SRAM0_D0: U1#1.27(IO_L37P_3)
SRAM0_D1: U1#1.29(IO_L36N_3)
SRAM0_D2: U1#1.30(IO_L36P_3)
SRAM0_D3: U1#1.32(IO_L2N_3)
SRAM0_D4: U1#1.79(IO_L47P_1)
SRAM0_D5: U1#1.81(IO_L46P_1)
SRAM0_D6: U1#1.80(IO_L46N_1)
SRAM0_D7: U1#1.82(IO_L45N_1)
SRAM0_D8: U1#1.10(IO_L50P_3)
SRAM0_D9: U1#1.8(IO_L51P_3)
SRAM0_D10: U1#1.9(IO_L50N_3)
SRAM0_D11: U1#1.7(IO_L51N_3)
SRAM0_D12: U1#1.100(IO_L33P_1)
SRAM0_D13: U1#1.98(IO_L34P_1)
SRAM0_D14: U1#1.99(IO_L33N_1)
SRAM0_D15: U1#1.97(IO_L34N_1)
SRAM0_HBE_N: U1#1.12(IO_L49P_3) ; port SRAM0.SRAM0_HBE_N
SRAM0_LBE_N: U1#1.11(IO_L49N_3) ; port SRAM0.SRAM0_LBE_N
SRAM0_OE_N: U1#1.14(IO_L44N_GCLK20_3) ; port SRAM0.SRAM0_OE_N
SRAM0_WE_N: U1#1.83(IO_L45P_1) ; port SRAM0.SRAM0_WE_N

Not connected (* = marked no-connect by the designer): U1#1 72(CMPCS_B_2)* 131(IO_L35N_GCLK16_0)

### Buses and harness runs
bus SRAM0_A[17..0]
bus SRAM0_D[15..0]

### Notes on the sheet
- (near R29) 4 x 33R
- (in symbol CMP-0067-00454-1, part A) BANK 0
- (in symbol CMP-0067-00454-1, part B) BANK 1
- (in symbol CMP-0067-00454-1, part C) BANK 2
- (in symbol CMP-0067-00454-1, part D) BANK 3

### Library data of the parts
R1 R3 = 0402 (1005 Metric) 1/16 W 100R 1 Thick Film Chip Resistor: Power: 1/16 W; Case-Metric: 1005; Case-EIA: 0402; Temp Coefficient ppm/°C: ±100; Tolerance %: 1%; Value (Ohms): 100; Technology: SMT
R2 R5 R6 R17-R21 = 0402 (1005 Metric) 1/16 W 4K7 1 Thick Film Chip Resistor: as R14 on sheet Arduino FPGA Design; Technology: SMT
R4 = 0402 (1005 Metric) 1/16 W 1K 1 Thick Film Chip Resistor: Power: 1/16 W; Case-Metric: 1005; Case-EIA: 0402; Temp Coefficient ppm/°C: ±100; Tolerance %: 1%; Value (Ohms): 1000; Technology: SMT
R9-R12 R24 R26 R27 R29 = 0402 (1005 Metric) 1/16 W 33R 1 Thick Film Chip Resistor: Power: 1/16 W; Case-EIA: 0402; Case-Metric: 1005; Temp Coefficient ppm/°C: ±100; Tolerance %: 1%; Value (Ohms): 33; Technology: SMT
  R24 R26 R27 R29: Value: 33R
R22 = 0402 (1005 Metric) 1/16 W 330R 1 Thick Film Chip Resistor: Case-EIA: 0402; Case-Metric: 1005; Power: 1/16 W; Temp Coefficient ppm/°C: ±100; Tolerance %: 1%; Value (Ohms): 330; Technology: SMT
U1#1 U1#2 = CMP-0067-00454-1: Spartan-6 LX 1.2V FPGA, 102 User I/Os, 144-Pin TQFP (0.5mm Pitch), Speed Grade 2, Commercial Grade, Pb-Free; PackageVersion: ver1.2, Jun-2004; DatasheetVersion: ver1.6, Nov-2010; PackageDescription: 144-Pin Thin Quad Flat Pack (TQG144) - Pb-Free; PackageReference: TQG144; Code_JEDEC: MS-026-BFB

## Sheet FPGA - Decoupling.SchDoc
size A4
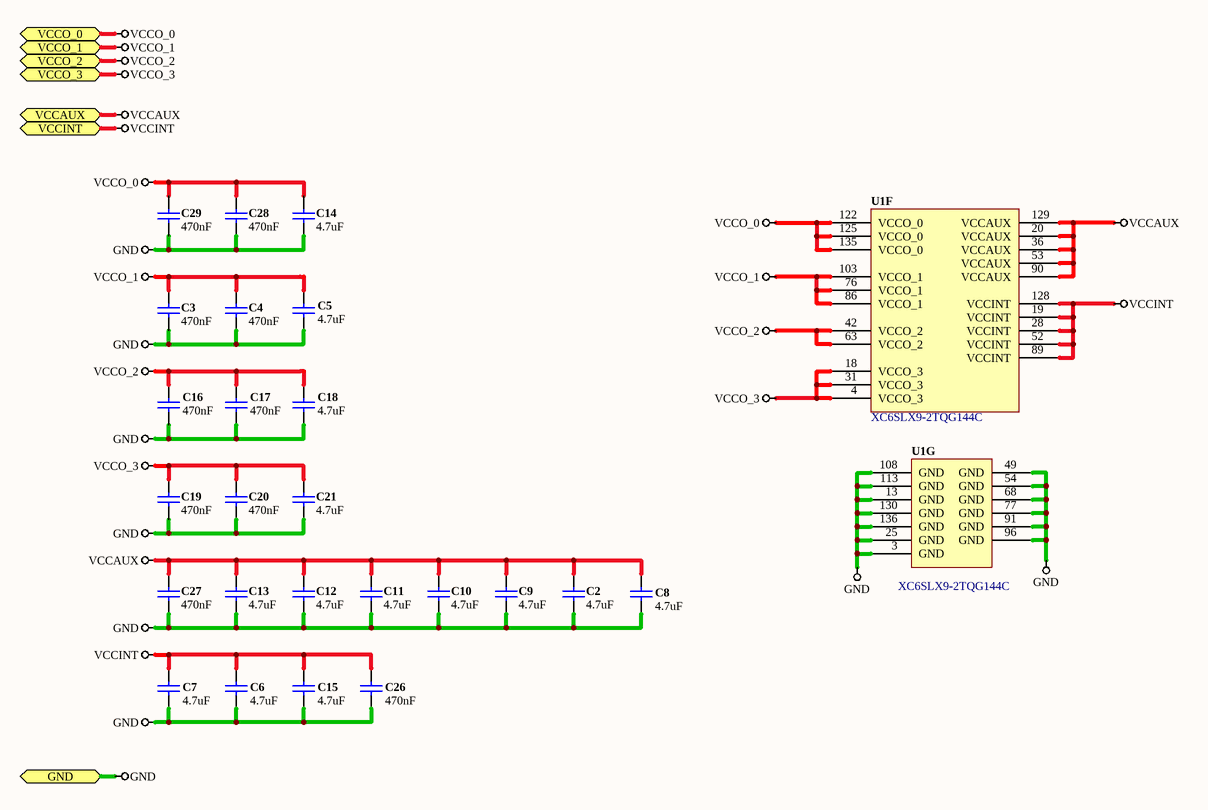
[diagram p4: FPGA - Decoupling.SchDoc]

### Parts
(Parts that share a designator on the sheet are numbered #1, #2 ... from top to bottom, then left to right.)
C2  value 4.7uF  [CAPC0603(1608)55_L]  (hidden comment: CAP 4.7uF 10V 0603(1608))
C3  value 470nF  [CAPC0402(1005)60_L]  (hidden comment: CAP 470nF 10V 0402(1005))
C4  value 470nF  [CAPC0402(1005)60_L]  (hidden comment: CAP 470nF 10V 0402(1005))
C5  value 4.7uF  [CAPC0603(1608)55_L]  (hidden comment: CAP 4.7uF 10V 0603(1608))
C6  value 4.7uF  [CAPC0603(1608)55_L]  (hidden comment: CAP 4.7uF 10V 0603(1608))
C7  value 4.7uF  [CAPC0603(1608)55_L]  (hidden comment: CAP 4.7uF 10V 0603(1608))
C8  value 4.7uF  [CAPC0603(1608)55_L]  (hidden comment: CAP 4.7uF 10V 0603(1608))
C9  value 4.7uF  [CAPC0603(1608)55_L]  (hidden comment: CAP 4.7uF 10V 0603(1608))
C10  value 4.7uF  [CAPC0603(1608)55_L]  (hidden comment: CAP 4.7uF 10V 0603(1608))
C11  value 4.7uF  [CAPC0603(1608)55_L]  (hidden comment: CAP 4.7uF 10V 0603(1608))
C12  value 4.7uF  [CAPC0603(1608)55_L]  (hidden comment: CAP 4.7uF 10V 0603(1608))
C13  value 4.7uF  [CAPC0603(1608)55_L]  (hidden comment: CAP 4.7uF 10V 0603(1608))
C14  value 4.7uF  [CAPC0603(1608)55_L]  (hidden comment: CAP 4.7uF 10V 0603(1608))
C15  value 4.7uF  [CAPC0603(1608)55_L]  (hidden comment: CAP 4.7uF 10V 0603(1608))
C16  value 470nF  [CAPC0402(1005)60_L]  (hidden comment: CAP 470nF 10V 0402(1005))
C17  value 470nF  [CAPC0402(1005)60_L]  (hidden comment: CAP 470nF 10V 0402(1005))
C18  value 4.7uF  [CAPC0603(1608)55_L]  (hidden comment: CAP 4.7uF 10V 0603(1608))
C19  value 470nF  [CAPC0402(1005)60_L]  (hidden comment: CAP 470nF 10V 0402(1005))
C20  value 470nF  [CAPC0402(1005)60_L]  (hidden comment: CAP 470nF 10V 0402(1005))
C21  value 4.7uF  [CAPC0603(1608)55_L]  (hidden comment: CAP 4.7uF 10V 0603(1608))
C26  value 470nF  [CAPC0402(1005)60_L]  (hidden comment: CAP 470nF 10V 0402(1005))
C27  value 470nF  [CAPC0402(1005)60_L]  (hidden comment: CAP 470nF 10V 0402(1005))
C28  value 470nF  [CAPC0402(1005)60_L]  (hidden comment: CAP 470nF 10V 0402(1005))
C29  value 470nF  [CAPC0402(1005)60_L]  (hidden comment: CAP 470nF 10V 0402(1005))
U1#1  XC6SLX9-2TQG144C  [TQG144_N]  (parts F,G of 7)

### Ports
GND, VCCAUX, VCCINT, VCCO_0, VCCO_1, VCCO_2, VCCO_3

### Nets
GND: C2.2 C3.1 C4.1 C5.2 C6.2 C7.2 C8.2 C9.2 C10.2 C11.2 C12.2 C13.2 C14.1 C15.2 C16.1 C17.1 C18.1 C19.1 C20.1 C21.1 C26.2 C27.2 C28.1 C29.1 U1#1.3(GND) U1#1.13(GND) U1#1.25(GND) U1#1.49(GND) U1#1.54(GND) U1#1.68(GND) U1#1.77(GND) U1#1.91(GND) U1#1.96(GND) U1#1.108(GND) U1#1.113(GND) U1#1.130(GND) U1#1.136(GND) ; port GND
VCCAUX: C2.1 C3.2 C4.2 C5.1 C8.1 C9.1 C10.1 C11.1 C12.1 C13.1 C14.2 C16.2 C17.2 C18.2 C19.2 C20.2 C21.2 C27.1 C28.2 C29.2 U1#1.4(VCCO_3) U1#1.18(VCCO_3) U1#1.20(VCCAUX) U1#1.31(VCCO_3) U1#1.36(VCCAUX) U1#1.42(VCCO_2) U1#1.53(VCCAUX) U1#1.63(VCCO_2) U1#1.76(VCCO_1) U1#1.86(VCCO_1) U1#1.90(VCCAUX) U1#1.103(VCCO_1) U1#1.122(VCCO_0) U1#1.125(VCCO_0) U1#1.129(VCCAUX) U1#1.135(VCCO_0) ; port VCCO_0, port VCCO_3, port VCCO_1, port VCCO_2, port VCCAUX  [also labelled VCCO_0, VCCO_1, VCCO_2, VCCO_3]  [project net 3V3]
VCCINT: C6.1 C7.1 C15.1 C26.1 U1#1.19(VCCINT) U1#1.28(VCCINT) U1#1.52(VCCINT) U1#1.89(VCCINT) U1#1.128(VCCINT) ; port VCCINT  [project net 1V2]

### Library data of the parts
C2 C5-C15 C18 C21 = CAP 4.7uF 10V ±10% 0603 (1608 Metric) Thickness 0.55mm SMD: Case-Metric: 1608; Case-EIA: 0603; Tolerance: ±10%; Rated Voltage: 10 V; Technology: SMT; Max Thickness: 0.55 mm
C3 C4 C16 C17 C19 C20 C26-C29 = CAP 470nF 10V ±10% 0402 (1005 Metric) Thickness 0.6mm SMD: Case-Metric: 1005; Case-EIA: 0402; Tolerance: ±10%; Rated Voltage: 10 V; Max Thickness: 0.6 mm; Technology: SMT
U1#1 = CMP-0067-00454-1: as U1#1 on sheet FPGA - XC6SLX9-2TQG144C; PackageVersion: ver1.2, Jun-2004; DatasheetVersion: ver1.6, Nov-2010; PackageDescription: 144-Pin Thin Quad Flat Pack (TQG144) - Pb-Free; PackageReference: TQG144; Code_JEDEC: MS-026-BFB

## Sheet Arduino FPGA SPI MUX.SchDoc
size A4
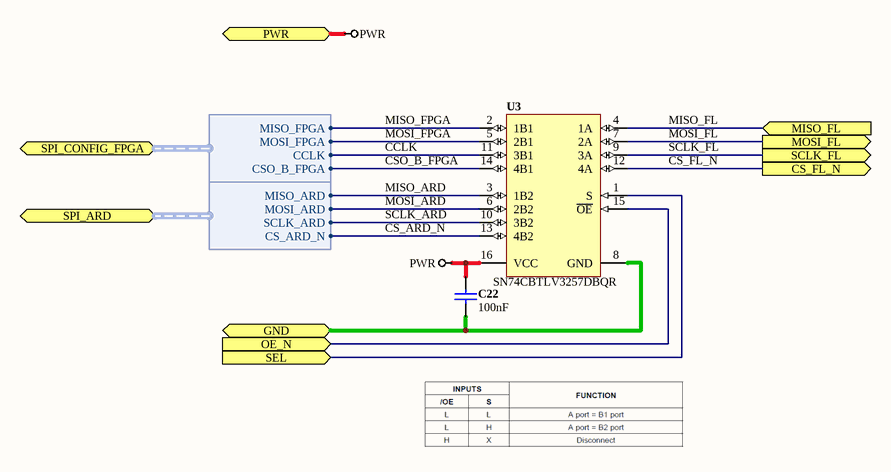
[diagram p5: Arduino FPGA SPI MUX.SchDoc]

### Parts
C22  value 100nF  [CAPC0402(1005)60_L]  (hidden comment: CAP 100nF 16V 0402(1005))
U3  SN74CBTLV3257DBQR  [TI-DBQ16_N]

### Ports
CS_FL_N (out), GND, MISO_FL (in), MOSI_FL (out), OE_N (in), PWR, SCLK_FL (out), SEL (in), SPI_ARD (harness SPI_ARD), SPI_CONFIG_FPGA (harness SPI_CONFIG_FPGA)

### Harnesses
SPI_CONFIG_FPGA: CSO_B_FPGA, CCLK, MISO_FPGA, MOSI_FPGA
SPI_ARD: MISO_ARD, MOSI_ARD, SCLK_ARD, CS_ARD_N

### Nets
GND: C22.2 U3.8(GND) U3.15(~{OE}) ; port OE_N, port GND
PWR: C22.1 U3.16(VCC) ; port PWR  [project net 3V3]
CCLK: U3.11(3B1) ; port SPI_CONFIG_FPGA.CCLK
CS_ARD_N: U3.13(4B2) ; port SPI_ARD.CS_ARD_N
CS_FL_N: U3.12(4A) ; port CS_FL_N
CSO_B_FPGA: U3.14(4B1) ; port SPI_CONFIG_FPGA.CSO_B_FPGA
MISO_ARD: U3.3(1B2) ; port SPI_ARD.MISO_ARD
MISO_FL: U3.4(1A) ; port MISO_FL
MISO_FPGA: U3.2(1B1) ; port SPI_CONFIG_FPGA.MISO_FPGA
MOSI_ARD: U3.6(2B2) ; port SPI_ARD.MOSI_ARD
MOSI_FL: U3.7(2A) ; port MOSI_FL
MOSI_FPGA: U3.5(2B1) ; port SPI_CONFIG_FPGA.MOSI_FPGA
SCLK_ARD: U3.10(3B2) ; port SPI_ARD.SCLK_ARD
SCLK_FL: U3.9(3A) ; port SCLK_FL
NetU3_1: U3.1(S) ; port SEL

### Library data of the parts
C22 = CAP 100nF 16V ±10% 0402 (1005 Metric) Thickness 0.6mm SMD: as C101 on sheet Arduino FPGA Design; Max Thickness: 0.6 mm; Rated Voltage: 16 V; Technology: SMT
U3 = CMP-0267-00001-1: Low-Voltage 4-Bit 1-Of-2 FET Multiplexer/Demultiplexer, 16-pin SOP (DBQ16); Supply Voltage: 2.3 to 3.6 V; Channel: 4; DatasheetVersion: SCDS040J, 10/2003; Mounting Technology: Surface Mount; PartNumber: SN74CBTLV3257DBQR; ComponentLink3URL: http://www.ti.com/lit/ml/msoi004g/msoi004g.pdf; ComponentLink2Description: Datasheet; ComponentLink1URL: http://www.ti.com/; PackageVersion: 4073301-2/H, 10/2008; ComponentLink1Description: Manufacturer URL; ComponentLink3Description: Package Specification; PackageDescription: 16-Pin Plastic Small Outline, 3.9 x 4.9 mm Body, 0.635 mm Pitch; ComponentLink2URL: http://www.ti.com/lit/ds/symlink/sn74cbtlv3257.pdf; PackageReference: DBQ16

## Sheet SRAM0 - IS61WV12816DBLL-10BLI.SchDoc
size A4
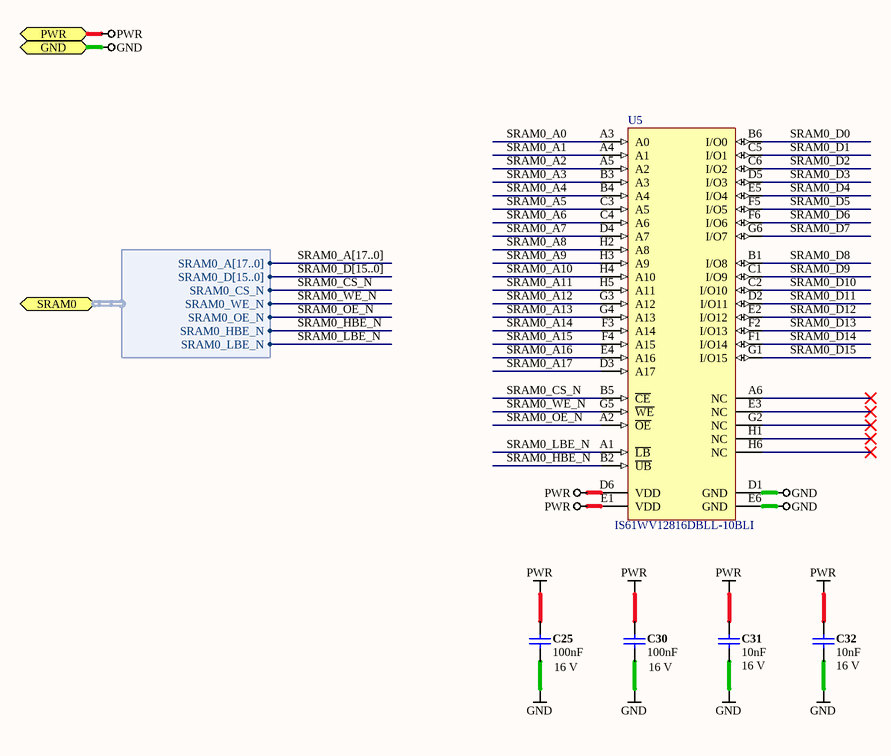
[diagram p6: SRAM0 - IS61WV12816DBLL-10BLI.SchDoc]

### Parts
C25  value 100nF  Rated Voltage: 16 V  [CAPC0402(1005)60_L]  (hidden comment: CAP 100nF 16V 0402(1005))
C30  value 100nF  Rated Voltage: 16 V  [CAPC0402(1005)60_L]  (hidden comment: CAP 100nF 16V 0402(1005))
C31  value 10nF  Rated Voltage: 16 V  [CAPC0402(1005)33_L]  (hidden comment: CAP 10nF 16V 0402(1005))
C32  value 10nF  Rated Voltage: 16 V  [CAPC0402(1005)33_L]  (hidden comment: CAP 10nF 16V 0402(1005))
U5  IS61WV12816DBLL-10BLI  [ISSI-TF-BGA-48-6000X8000DE]

### Ports
GND, PWR, SRAM0 (harness SRAM0)

### Harnesses
SRAM0: SRAM0_A[17..0], SRAM0_D[15..0], SRAM0_CS_N, SRAM0_WE_N, SRAM0_OE_N, SRAM0_HBE_N, SRAM0_LBE_N

### Nets
GND: C25.2 C30.2 C31.2 C32.2 U5.D1(GND) U5.E6(GND) ; port GND
PWR: C25.1 C30.1 C31.1 C32.1 U5.D6(VDD) U5.E1(VDD) ; port PWR  [project net 3V3]
SRAM0_A0: U5.A3(A0)
SRAM0_A1: U5.A4(A1)
SRAM0_A2: U5.A5(A2)
SRAM0_A3: U5.B3(A3)
SRAM0_A4: U5.B4(A4)
SRAM0_A5: U5.C3(A5)
SRAM0_A6: U5.C4(A6)
SRAM0_A7: U5.D4(A7)
SRAM0_A8: U5.H2(A8)
SRAM0_A9: U5.H3(A9)
SRAM0_A10: U5.H4(A10)
SRAM0_A11: U5.H5(A11)
SRAM0_A12: U5.G3(A12)
SRAM0_A13: U5.G4(A13)
SRAM0_A14: U5.F3(A14)
SRAM0_A15: U5.F4(A15)
SRAM0_A16: U5.E4(A16)
SRAM0_A17: U5.D3(A17)
SRAM0_CS_N: U5.B5(~{CE}) ; port SRAM0.SRAM0_CS_N
SRAM0_D0: U5.B6(I/O0)
SRAM0_D1: U5.C5(I/O1)
SRAM0_D2: U5.C6(I/O2)
SRAM0_D3: U5.D5(I/O3)
SRAM0_D4: U5.E5(I/O4)
SRAM0_D5: U5.F5(I/O5)
SRAM0_D6: U5.F6(I/O6)
SRAM0_D7: U5.G6(I/O7)
SRAM0_D8: U5.B1(I/O8)
SRAM0_D9: U5.C1(I/O9)
SRAM0_D10: U5.C2(I/O10)
SRAM0_D11: U5.D2(I/O11)
SRAM0_D12: U5.E2(I/O12)
SRAM0_D13: U5.F2(I/O13)
SRAM0_D14: U5.F1(I/O14)
SRAM0_D15: U5.G1(I/O15)
SRAM0_HBE_N: U5.B2(~{UB}) ; port SRAM0.SRAM0_HBE_N
SRAM0_LBE_N: U5.A1(~{LB}) ; port SRAM0.SRAM0_LBE_N
SRAM0_OE_N: U5.A2(~{OE}) ; port SRAM0.SRAM0_OE_N
SRAM0_WE_N: U5.G5(~{WE}) ; port SRAM0.SRAM0_WE_N

Not connected (* = marked no-connect by the designer): U5 A6(NC)* E3(NC)* G2(NC)* H1(NC)* H6(NC)*

### Buses and harness runs
bus SRAM0_A[17..0]
bus SRAM0_D[15..0]

### Library data of the parts
C25 C30 = CAP 100nF 16V ±10% 0402 (1005 Metric) Thickness 0.6mm SMD: as C101 on sheet Arduino FPGA Design; Max Thickness: 0.6 mm; Technology: SMT
C31 C32 = CMP-1034-01875-1: CAP 10nF 16V ±10% 0402 (1005 Metric) Thickness 0.33mm SMD; Case-EIA: 0402; Case-Metric: 1005; Max Thickness: 0.33 mm; Tolerance: ±10%; Technology: SMT
U5 = CMP-0513-00111-1: 2 M High Speed Asynchronous CMOS SRAM, 128 K x 16, -40 to 85 degC, 48-Pin BGA (TF-BGA-48), Pb-Free; Manufacturer: Integrated Silicon Solution Inc (ISSI); Speed (ns): 10; Packing: Tray / Tube; Mounting Technology: Surface Mount; DatasheetVersion: Rev. D; PackageReference: TF-BGA-48; ComponentLink2URL: http://www.issi.com/WW/pdf/61-64WV12816DAxx-DBxx.pdf; PartNumber: IS61WV12816DBLL-10BLI; ComponentLink2Description: Datasheet; PackageDescription: 48-Pin 6 x 8 mm TF-BGA, Pitch 0.75 mm; ComponentLink1Description: Manufacturer URL; Code_JEDEC: MO-207; PackageVersion: Rev. C, 08/2008; Organization: 128K x 16; RoHS: Pb-Free; ComponentLink1URL: http://www.issi.com/US/index.shtml; ComponentLink3URL: http://www.issi.com/WW/pdf/61-64WV25616.pdf; ComponentLink3Description: Package Specification

## Sheet Power - 5V0.SchDoc
size A4
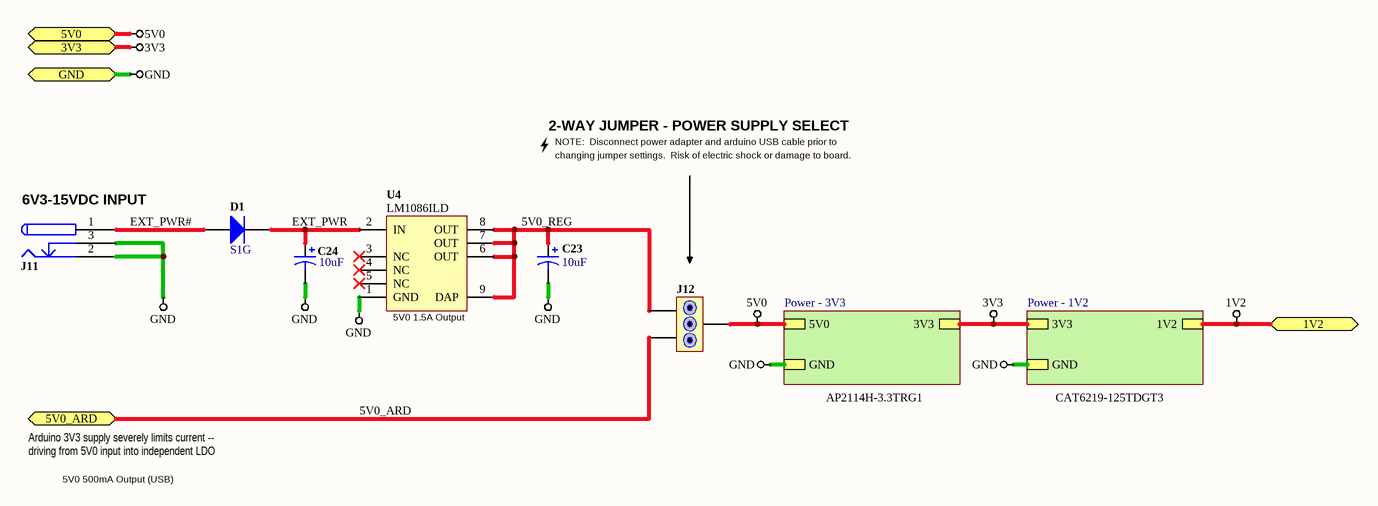
[diagram p7: Power - 5V0.SchDoc]

### Parts
C23  Capacitance: 10uF  [AVX-CAPC3528_V]  (hidden comment: TAJB106K020R)
C24  Capacitance: 10uF  [AVX-CAPC3528_V]  (hidden comment: TAJB106K020R)
D1  S1G  [DO-214AC]
J11  PWR CONNECTOR  [KLD-0202]  (value not drawn)
J12  3-WAY JUMPER  [HDR1X3]  (value not drawn)
U4  Abbreviated Name: LM1086ILD  [LDC08A]  (hidden comment: LM1086ILD-3.3/NOPB)

### Sub-sheets
Power - 1V2 = Power - 1V2.SchDoc (file not in this document): GND, 3V3, 1V2
Power - 3V3 = Power - 3V3.SchDoc: GND, 5V0, 3V3

### Ports
1V2, 3V3, 5V0, 5V0_ARD, GND

### Nets
1V2: port 1V2, sheet Power - 1V2/1V2
3V3: port 3V3, sheet Power - 3V3/3V3, sheet Power - 1V2/3V3
5V0: J12.2 ; port 5V0, sheet Power - 3V3/5V0
5V0_ARD: J12.3 ; port 5V0_ARD
GND: C23.2 C24.2 J11.2 J11.3 U4.1(GND) ; port GND, sheet Power - 3V3/GND, sheet Power - 1V2/GND
5V0_REG: C23.1 J12.1 U4.6(OUT) U4.7(OUT) U4.8(OUT) U4.9(DAP)
EXT_PWR: C24.1 D1.2 U4.2(IN)
EXT_PWR#: D1.1 J11.1

Not connected (* = marked no-connect by the designer): U4 3(NC)* 4(NC)* 5(NC)*

### Notes on the sheet
- 2-WAY JUMPER - POWER SUPPLY SELECT
- NOTE:  Disconnect power adapter and arduino USB cable prior to
- (near J11) 6V3-15VDC INPUT
- changing jumper settings.  Risk of electric shock or damage to board.
- (near U4) 5V0 1.5A Output
- AP2114H-3.3TRG1
- CAT6219-125TDGT3
- Arduino 3V3 supply severely limits current --
- driving from 5V0 input into independent LDO
- 5V0 500mA Output (USB)

### Library data of the parts
C23 C24 = CMP-0279-00001-1: Capacitor, Tantalum, 10uF 10% 20V MCCT-B (3528); Manufacturer: AVX; Polarity: Polarized; PartNumber: TAJB106K020R; PackageDescription: 2-Pin SMT Capacitor, 3.5 x 2.8 mm Body; ComponentLink1URL: http://www.avx.com/; PackageReference: CAPC3528; ComponentLink2Description: Datasheet; Technology: Tantalum; ComponentLink2URL: http://www.avx.com/docs/Catalogs/taj.pdf; Tolerance: 10%; ComponentLink1Description: Manufacturer URL; Rated Voltage: 20V; DatasheetVersion: Jun-13; Mounting Technology: Surface Mount
D1 = S1G: Fairchild S1G General Purpose Rectifier; Vrrm: 400V; If(AV): 1.0A; Ifsm: 30A; Pd: 1.4W; Trr: 1.8uS; Ct: 6.6pF; Package: DO-214AC
J11 = POWER-CONNECTOR-3: Connector, 3 Conductor Power Jack; Connector type: POWERJACK 3 HEADER; ClassName: PWR_CONN_5V0; Category: Connector; Mounting Technology: PTH; Pin Count: 3
J12 = 3-WAY JUMPER: 3-Way Jumper - Center Output
U4 = CMP-0062-01489-2: 1.5A Low Dropout Positive Regulators, 8-pin LLP, Pb-Free; Manufacturer: National Semiconductor; PowerWise: N; CompType: LDO IC; PackageTopMarking: NS*UZXYTT*1086I33; ComponentLink1Description: LM1086 Datasheet; RoHS: Y; ComponentLink2URL: http://www.national.com/pf/LM/LM1086.html; PinCount: 8; DatasheetVersion: Jun-2005; ComponentLink2Description: LM1086 Web Page; ComponentLink3URL: http://www.national.com/packaging/folders/ldc08a.html; ComponentLink1URL: http://www.national.com/ds/LM/LM1086.pdf; PackageReference: LDC08A; PackageVersion: revB, Jun-2003; ComponentLink3Description: LDC08A Package Page; PackageDescription: LLP, Plastic, Dual, 4 x 4 x 0.75mm Body, 8 Lead, 0.8mm Pitch; RevisionNote: Component URLs added

## Sheet Power - 3V3.SchDoc
size A4
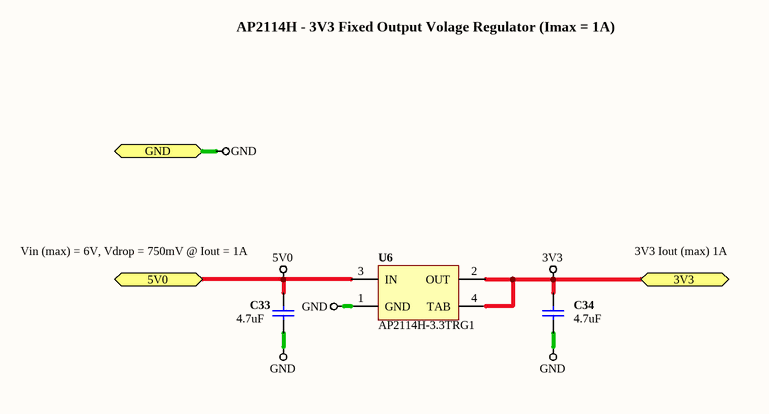
[diagram p8: Power - 3V3.SchDoc]

### Parts
C33  value 4.7uF  [CAPC0603(1608)55_L]  (hidden comment: CAP 4.7uF 10V 0603(1608))
C34  value 4.7uF  [CAPC0603(1608)55_L]  (hidden comment: CAP 4.7uF 10V 0603(1608))
U6  AP2114H-3.3TRG1  [SOT230P700X180-4L]

### Ports
3V3, 5V0, GND

### Nets
3V3: C34.1 U6.2(OUT) U6.4(TAB) ; port 3V3
5V0: C33.1 U6.3(IN) ; port 5V0
GND: C33.2 C34.2 U6.1(GND) ; port GND

### Notes on the sheet
- AP2114H - 3V3 Fixed Output Volage Regulator (Imax = 1A)
- (near C33) Vin (max) = 6V, Vdrop = 750mV @ Iout = 1A
- 3V3 Iout (max) 1A

### Library data of the parts
C33 C34 = CAP 4.7uF 10V ±10% 0603 (1608 Metric) Thickness 0.55mm SMD: as C2 on sheet FPGA - Decoupling; Rated Voltage: 10 V; Technology: SMT; Max Thickness: 0.55 mm
U6 = AP2114H-3.3TRG1: AP2114, 1A Low Dropout Positive Fixed 3V3 Regulator; Max Input Voltage: 6V; Max Output Voltage: 3.34V; Min Input Voltage: -0.3V; Min Output Voltage: 3.25V; Supply Voltage: 5V; Max Output Current: 1A; Mounting Technology: Surface Mount; Status: Unreleased; Temperature Range: -40 - 125 degC; Category: IC-Power

## Sheet LEDS - Status.SchDoc
size A4
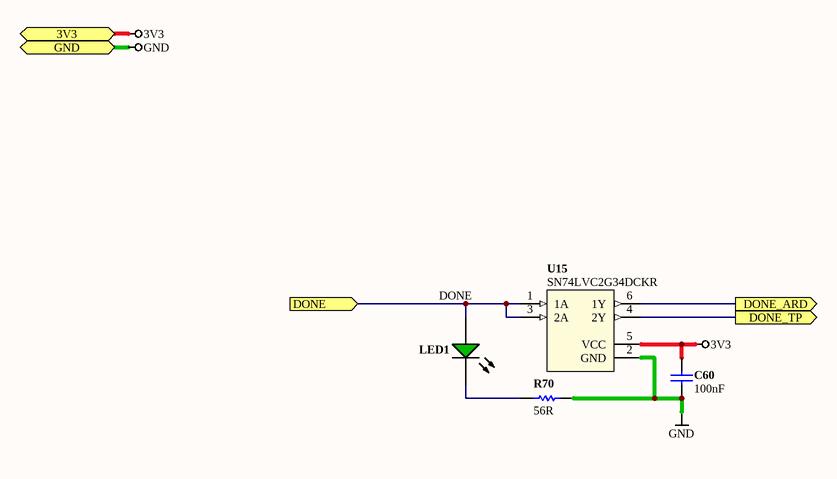
[diagram p9: LEDS - Status.SchDoc]

### Parts
C60  value 100nF  [CAPC0402(1005)60_L]  (hidden comment: CAP 100nF 10V 0402(1005))
LED1  LED_GREEN_APT1608SGC  [LED0603]  (value not drawn)
R70  value 56R  [RESC0402(1005)_L]  (hidden comment: 56R 1% 0402(1005))
U15  SN74LVC2G34DCKR  [TI-DCK6_L]

### Ports
3V3, DONE (in), DONE_ARD (out), DONE_TP (out), GND

### Nets
3V3: C60.2 U15.5(VCC) ; port 3V3
GND: C60.1 R70.2 U15.2(GND) ; port GND
DONE: LED1.1(A) U15.1(1A) U15.3(2A) ; port DONE
DONE_ARD: U15.6(1Y) ; port DONE_ARD
DONE_TP: U15.4(2Y) ; port DONE_TP
NetLED1_2: LED1.2(K) R70.1

### Library data of the parts
C60 = CMP-1034-02064-1: CAP 100nF 10V ±5% 0402 (1005 Metric) Thickness 0.6mm SMD; Case-EIA: 0402; Case-Metric: 1005; Max Thickness: 0.6 mm; Tolerance: ±5%; Rated Voltage: 10 V; Technology: SMT
LED1 = LED_GREEN_APT1608SGC: SMD 0603 LED, GREEN; DefaultDesignator: LED?; Class: Diodes; Forward Voltage (Vf): 2.2V; PartNumber: APT1608SGC; Sub Class: LED; Color: Green
R70 = CMP-1011-00369-1: 56R 0.063W 1% 0402 (1005 Metric)  SMD; Case-Metric: 1005; Case-EIA: 0402; Power: 0.063 W; Tolerance: 1 %; Technology: SMT
U15 = SN74LVC2G34DCKR: IC BUFFER DUAL NON-INV SC706; Manufacturer: Texas Instruments; DefaultDesignator: U?; Class: Logic; Sub Class: Buffer-Line Driver; Description2: IC BUFF/DVR TRI-ST OCTAL 20-VQFN; Logic Type: Buffer/Line Driver, Non-Inverting; Number of Elements: 2; Number of Bits per Element: 4; Current - Output High, Low: 24mA, 24mA; Voltage - Supply: 1.65 V ~ 3.6 V; PartNumber: SN74LVC2G34DCKR; ComponentLink1Description: Datasheet; ComponentLink1URL: http://www.ti.com/lit/ds/symlink/sn74lvc2g34.pdf; ComponentLink2Description: Manufacturer; ComponentLink2URL: www.ti.com; Series: 74LVC; Operating Temperature: -40°C ~ 125°C

## Nets that join several sheets
1V2: Arduino FPGA Top-Level Interface (J100.27 J100.28), FPGA - Decoupling (9 pins)
3V3: Arduino FPGA Top-Level Interface (J1.2 J5.9 J100.31 J100.32), Arduino FPGA Design (C101.1 X2.4), Flash - S25FL216K0PMFI041 (C1.1 R7.2 R8.2 U2.8), FPGA - XC6SLX9-2TQG144C (10 pins), FPGA - Decoupling (36 pins), Arduino FPGA SPI MUX (C22.1 U3.16), SRAM0 - IS61WV12816DBLL-10BLI (6 pins), Power - 3V3 (C34.1 U6.2 U6.4), LEDS - Status (C60.2 U15.5)
5V0: Arduino FPGA Top-Level Interface (J1.1 J100.25 J100.26), Power - 5V0 (J12.2), Power - 3V3 (C33.1 U6.3)
5V0_ARD: Arduino FPGA Top-Level Interface (J7.5), Power - 5V0 (J12.3)
GND: Arduino FPGA Top-Level Interface (9 pins), Arduino FPGA Design (C101.2 R14.1 X2.2), Flash - S25FL216K0PMFI041 (C1.2 U2.4), FPGA - XC6SLX9-2TQG144C (R3.1 R4.1 U1#1.73), FPGA - Decoupling (37 pins), Arduino FPGA SPI MUX (C22.2 U3.8 U3.15), SRAM0 - IS61WV12816DBLL-10BLI (6 pins), Power - 5V0 (5 pins), Power - 3V3 (C33.2 C34.2 U6.1), LEDS - Status (C60.1 R70.2 U15.2)
ARD_D0(RX): Arduino FPGA Top-Level Interface (J8.1), FPGA - XC6SLX9-2TQG144C (U1#2.55)
ARD_D1(TX): Arduino FPGA Top-Level Interface (J8.2), FPGA - XC6SLX9-2TQG144C (U1#2.57)
ARD_D3: Arduino FPGA Top-Level Interface (J8.4), FPGA - XC6SLX9-2TQG144C (U1#2.59)
ARD_D4: Arduino FPGA Top-Level Interface (J8.5), FPGA - XC6SLX9-2TQG144C (U1#2.61)
ARD_D5: Arduino FPGA Top-Level Interface (J8.6), FPGA - XC6SLX9-2TQG144C (U1#2.62)
ARD_D6: Arduino FPGA Top-Level Interface (J8.7), FPGA - XC6SLX9-2TQG144C (U1#2.64)
ARD_D8: Arduino FPGA Top-Level Interface (J9.1), FPGA - XC6SLX9-2TQG144C (U1#1.74)
ARD_D11: Arduino FPGA Top-Level Interface (J9.4), FPGA - XC6SLX9-2TQG144C (U1#1.102)
ARD_D12: Arduino FPGA Top-Level Interface (J9.5), FPGA - XC6SLX9-2TQG144C (U1#1.104)
ARD_D13: Arduino FPGA Top-Level Interface (J9.6), FPGA - XC6SLX9-2TQG144C (U1#1.105)
CCLK: FPGA - XC6SLX9-2TQG144C (R1.1 R3.2 U1#2.70), Arduino FPGA SPI MUX (U3.11)
CS_ARD_ALT_N: Arduino FPGA Top-Level Interface (J9.2 J13.3), FPGA - XC6SLX9-2TQG144C (U1#1.75)
CS_ARD_N: Arduino FPGA Top-Level Interface (J13.2), FPGA - XC6SLX9-2TQG144C (U1#2.48), Arduino FPGA SPI MUX (U3.13)
CS_ARD_STD_N: Arduino FPGA Top-Level Interface (J9.3 J13.1), FPGA - XC6SLX9-2TQG144C (U1#1.101)
CS_FL_N: Flash - S25FL216K0PMFI041 (U2.1), Arduino FPGA SPI MUX (U3.12)
CSO_B_FPGA: FPGA - XC6SLX9-2TQG144C (R6.1 U1#2.38), Arduino FPGA SPI MUX (U3.14)
DONE: FPGA - XC6SLX9-2TQG144C (R22.1 U1#1.71), LEDS - Status (LED1.1 U15.1 U15.3)
DONE#_ARD_D7: Arduino FPGA Top-Level Interface (J14.3), FPGA - XC6SLX9-2TQG144C (U1#2.67)
DONE_ARD: Arduino FPGA Top-Level Interface (J14.1), LEDS - Status (U15.6)
DONE_TP: Arduino FPGA Top-Level Interface (TP1.1), LEDS - Status (U15.4)
FPGA_CLK: Arduino FPGA Design (R13.1), FPGA - XC6SLX9-2TQG144C (U1#2.56)
HARD_TCK: Arduino FPGA Top-Level Interface (J5.1), FPGA - XC6SLX9-2TQG144C (R17.1 R24.1)
HARD_TDI: Arduino FPGA Top-Level Interface (J5.3), FPGA - XC6SLX9-2TQG144C (R18.1 R26.1)
HARD_TDO: Arduino FPGA Top-Level Interface (J5.5), FPGA - XC6SLX9-2TQG144C (R19.1 R27.1)
HARD_TMS: Arduino FPGA Top-Level Interface (J5.7), FPGA - XC6SLX9-2TQG144C (R20.1 R29.1)
IO0: Arduino FPGA Top-Level Interface (J100.1), FPGA - XC6SLX9-2TQG144C (U1#1.116)
IO1: Arduino FPGA Top-Level Interface (J100.2), FPGA - XC6SLX9-2TQG144C (U1#1.117)
IO2: Arduino FPGA Top-Level Interface (J100.3), FPGA - XC6SLX9-2TQG144C (U1#1.118)
IO3: Arduino FPGA Top-Level Interface (J100.4), FPGA - XC6SLX9-2TQG144C (U1#1.119)
IO4: Arduino FPGA Top-Level Interface (J100.5), FPGA - XC6SLX9-2TQG144C (U1#1.120)
IO5: Arduino FPGA Top-Level Interface (J100.6), FPGA - XC6SLX9-2TQG144C (U1#1.121)
IO6: Arduino FPGA Top-Level Interface (J100.7), FPGA - XC6SLX9-2TQG144C (U1#1.123)
IO7: Arduino FPGA Top-Level Interface (J100.8), FPGA - XC6SLX9-2TQG144C (U1#1.124)
IO8: Arduino FPGA Top-Level Interface (J100.9), FPGA - XC6SLX9-2TQG144C (U1#1.126)
IO9: Arduino FPGA Top-Level Interface (J100.10), FPGA - XC6SLX9-2TQG144C (U1#1.127)
IO10: Arduino FPGA Top-Level Interface (J100.11), FPGA - XC6SLX9-2TQG144C (U1#1.132)
IO11: Arduino FPGA Top-Level Interface (J100.12), FPGA - XC6SLX9-2TQG144C (U1#1.133)
IO12: Arduino FPGA Top-Level Interface (J100.13), FPGA - XC6SLX9-2TQG144C (U1#1.134)
IO13: Arduino FPGA Top-Level Interface (J100.14), FPGA - XC6SLX9-2TQG144C (U1#1.137)
IO14: Arduino FPGA Top-Level Interface (J100.15), FPGA - XC6SLX9-2TQG144C (U1#1.138)
IO15: Arduino FPGA Top-Level Interface (J100.16), FPGA - XC6SLX9-2TQG144C (U1#1.139)
IO16: Arduino FPGA Top-Level Interface (J100.17), FPGA - XC6SLX9-2TQG144C (U1#1.140)
IO17: Arduino FPGA Top-Level Interface (J100.18), FPGA - XC6SLX9-2TQG144C (U1#1.141)
IO18: Arduino FPGA Top-Level Interface (J100.19), FPGA - XC6SLX9-2TQG144C (U1#1.142)
IO19: Arduino FPGA Top-Level Interface (J100.20), FPGA - XC6SLX9-2TQG144C (U1#1.143)
IO20: Arduino FPGA Top-Level Interface (J100.21), FPGA - XC6SLX9-2TQG144C (U1#1.144)
IO21: Arduino FPGA Top-Level Interface (J100.22), FPGA - XC6SLX9-2TQG144C (U1#1.1)
IO22: Arduino FPGA Top-Level Interface (J100.23), FPGA - XC6SLX9-2TQG144C (U1#1.2)
IO23: Arduino FPGA Top-Level Interface (J100.24), FPGA - XC6SLX9-2TQG144C (U1#1.5)
MISO_ARD: Arduino FPGA Top-Level Interface (J10.1), FPGA - XC6SLX9-2TQG144C (U1#2.46), Arduino FPGA SPI MUX (U3.3)
MISO_FL: Flash - S25FL216K0PMFI041 (U2.2), Arduino FPGA SPI MUX (U3.4)
MISO_FPGA: FPGA - XC6SLX9-2TQG144C (U1#2.65), Arduino FPGA SPI MUX (U3.2)
MOSI_ARD: Arduino FPGA Top-Level Interface (J10.4), FPGA - XC6SLX9-2TQG144C (U1#2.47), Arduino FPGA SPI MUX (U3.6)
MOSI_FL: Flash - S25FL216K0PMFI041 (U2.5), Arduino FPGA SPI MUX (U3.7)
MOSI_FPGA: FPGA - XC6SLX9-2TQG144C (U1#2.66), Arduino FPGA SPI MUX (U3.5)
MUX_SEL: Arduino FPGA Top-Level Interface (J8.3), Arduino FPGA Design (R14.2), FPGA - XC6SLX9-2TQG144C (U1#2.58)
SCLK_ARD: Arduino FPGA Top-Level Interface (J10.3), FPGA - XC6SLX9-2TQG144C (U1#2.50), Arduino FPGA SPI MUX (U3.10)
SCLK_FL: Flash - S25FL216K0PMFI041 (U2.6), Arduino FPGA SPI MUX (U3.9)
SOFT_TCK: Arduino FPGA Top-Level Interface (J5.2), FPGA - XC6SLX9-2TQG144C (R9.1)
SOFT_TDI: Arduino FPGA Top-Level Interface (J5.4), FPGA - XC6SLX9-2TQG144C (R10.1)
SOFT_TDO: Arduino FPGA Top-Level Interface (J5.6), FPGA - XC6SLX9-2TQG144C (R11.1)
SOFT_TMS: Arduino FPGA Top-Level Interface (J5.8), FPGA - XC6SLX9-2TQG144C (R12.1)
SRAM0_A0: FPGA - XC6SLX9-2TQG144C (U1#1.16), SRAM0 - IS61WV12816DBLL-10BLI (U5.A3)
SRAM0_A1: FPGA - XC6SLX9-2TQG144C (U1#1.21), SRAM0 - IS61WV12816DBLL-10BLI (U5.A4)
SRAM0_A2: FPGA - XC6SLX9-2TQG144C (U1#1.24), SRAM0 - IS61WV12816DBLL-10BLI (U5.A5)
SRAM0_A3: FPGA - XC6SLX9-2TQG144C (U1#1.17), SRAM0 - IS61WV12816DBLL-10BLI (U5.B3)
SRAM0_A4: FPGA - XC6SLX9-2TQG144C (U1#1.23), SRAM0 - IS61WV12816DBLL-10BLI (U5.B4)
SRAM0_A5: FPGA - XC6SLX9-2TQG144C (U1#1.15), SRAM0 - IS61WV12816DBLL-10BLI (U5.C3)
SRAM0_A6: FPGA - XC6SLX9-2TQG144C (U1#1.22), SRAM0 - IS61WV12816DBLL-10BLI (U5.C4)
SRAM0_A7: FPGA - XC6SLX9-2TQG144C (U1#1.33), SRAM0 - IS61WV12816DBLL-10BLI (U5.D4)
SRAM0_A8: FPGA - XC6SLX9-2TQG144C (U1#1.95), SRAM0 - IS61WV12816DBLL-10BLI (U5.H2)
SRAM0_A9: FPGA - XC6SLX9-2TQG144C (U1#1.93), SRAM0 - IS61WV12816DBLL-10BLI (U5.H3)
SRAM0_A10: FPGA - XC6SLX9-2TQG144C (U1#1.88), SRAM0 - IS61WV12816DBLL-10BLI (U5.H4)
SRAM0_A11: FPGA - XC6SLX9-2TQG144C (U1#1.84), SRAM0 - IS61WV12816DBLL-10BLI (U5.H5)
SRAM0_A12: FPGA - XC6SLX9-2TQG144C (U1#1.92), SRAM0 - IS61WV12816DBLL-10BLI (U5.G3)
SRAM0_A13: FPGA - XC6SLX9-2TQG144C (U1#1.87), SRAM0 - IS61WV12816DBLL-10BLI (U5.G4)
SRAM0_A14: FPGA - XC6SLX9-2TQG144C (U1#1.94), SRAM0 - IS61WV12816DBLL-10BLI (U5.F3)
SRAM0_A15: FPGA - XC6SLX9-2TQG144C (U1#1.85), SRAM0 - IS61WV12816DBLL-10BLI (U5.F4)
SRAM0_A16: FPGA - XC6SLX9-2TQG144C (U1#1.78), SRAM0 - IS61WV12816DBLL-10BLI (U5.E4)
SRAM0_A17: FPGA - XC6SLX9-2TQG144C (U1#1.6), SRAM0 - IS61WV12816DBLL-10BLI (U5.D3)
SRAM0_CS_N: FPGA - XC6SLX9-2TQG144C (U1#1.26), SRAM0 - IS61WV12816DBLL-10BLI (U5.B5)
SRAM0_D0: FPGA - XC6SLX9-2TQG144C (U1#1.27), SRAM0 - IS61WV12816DBLL-10BLI (U5.B6)
SRAM0_D1: FPGA - XC6SLX9-2TQG144C (U1#1.29), SRAM0 - IS61WV12816DBLL-10BLI (U5.C5)
SRAM0_D2: FPGA - XC6SLX9-2TQG144C (U1#1.30), SRAM0 - IS61WV12816DBLL-10BLI (U5.C6)
SRAM0_D3: FPGA - XC6SLX9-2TQG144C (U1#1.32), SRAM0 - IS61WV12816DBLL-10BLI (U5.D5)
SRAM0_D4: FPGA - XC6SLX9-2TQG144C (U1#1.79), SRAM0 - IS61WV12816DBLL-10BLI (U5.E5)
SRAM0_D5: FPGA - XC6SLX9-2TQG144C (U1#1.81), SRAM0 - IS61WV12816DBLL-10BLI (U5.F5)
SRAM0_D6: FPGA - XC6SLX9-2TQG144C (U1#1.80), SRAM0 - IS61WV12816DBLL-10BLI (U5.F6)
SRAM0_D7: FPGA - XC6SLX9-2TQG144C (U1#1.82), SRAM0 - IS61WV12816DBLL-10BLI (U5.G6)
SRAM0_D8: FPGA - XC6SLX9-2TQG144C (U1#1.10), SRAM0 - IS61WV12816DBLL-10BLI (U5.B1)
SRAM0_D9: FPGA - XC6SLX9-2TQG144C (U1#1.8), SRAM0 - IS61WV12816DBLL-10BLI (U5.C1)
SRAM0_D10: FPGA - XC6SLX9-2TQG144C (U1#1.9), SRAM0 - IS61WV12816DBLL-10BLI (U5.C2)
SRAM0_D11: FPGA - XC6SLX9-2TQG144C (U1#1.7), SRAM0 - IS61WV12816DBLL-10BLI (U5.D2)
SRAM0_D12: FPGA - XC6SLX9-2TQG144C (U1#1.100), SRAM0 - IS61WV12816DBLL-10BLI (U5.E2)
SRAM0_D13: FPGA - XC6SLX9-2TQG144C (U1#1.98), SRAM0 - IS61WV12816DBLL-10BLI (U5.F2)
SRAM0_D14: FPGA - XC6SLX9-2TQG144C (U1#1.99), SRAM0 - IS61WV12816DBLL-10BLI (U5.F1)
SRAM0_D15: FPGA - XC6SLX9-2TQG144C (U1#1.97), SRAM0 - IS61WV12816DBLL-10BLI (U5.G1)
SRAM0_HBE_N: FPGA - XC6SLX9-2TQG144C (U1#1.12), SRAM0 - IS61WV12816DBLL-10BLI (U5.B2)
SRAM0_LBE_N: FPGA - XC6SLX9-2TQG144C (U1#1.11), SRAM0 - IS61WV12816DBLL-10BLI (U5.A1)
SRAM0_OE_N: FPGA - XC6SLX9-2TQG144C (U1#1.14), SRAM0 - IS61WV12816DBLL-10BLI (U5.A2)
SRAM0_WE_N: FPGA - XC6SLX9-2TQG144C (U1#1.83), SRAM0 - IS61WV12816DBLL-10BLI (U5.G5)